# Altium project 03-425A-01A.PrjPcb (part 1 of 3)
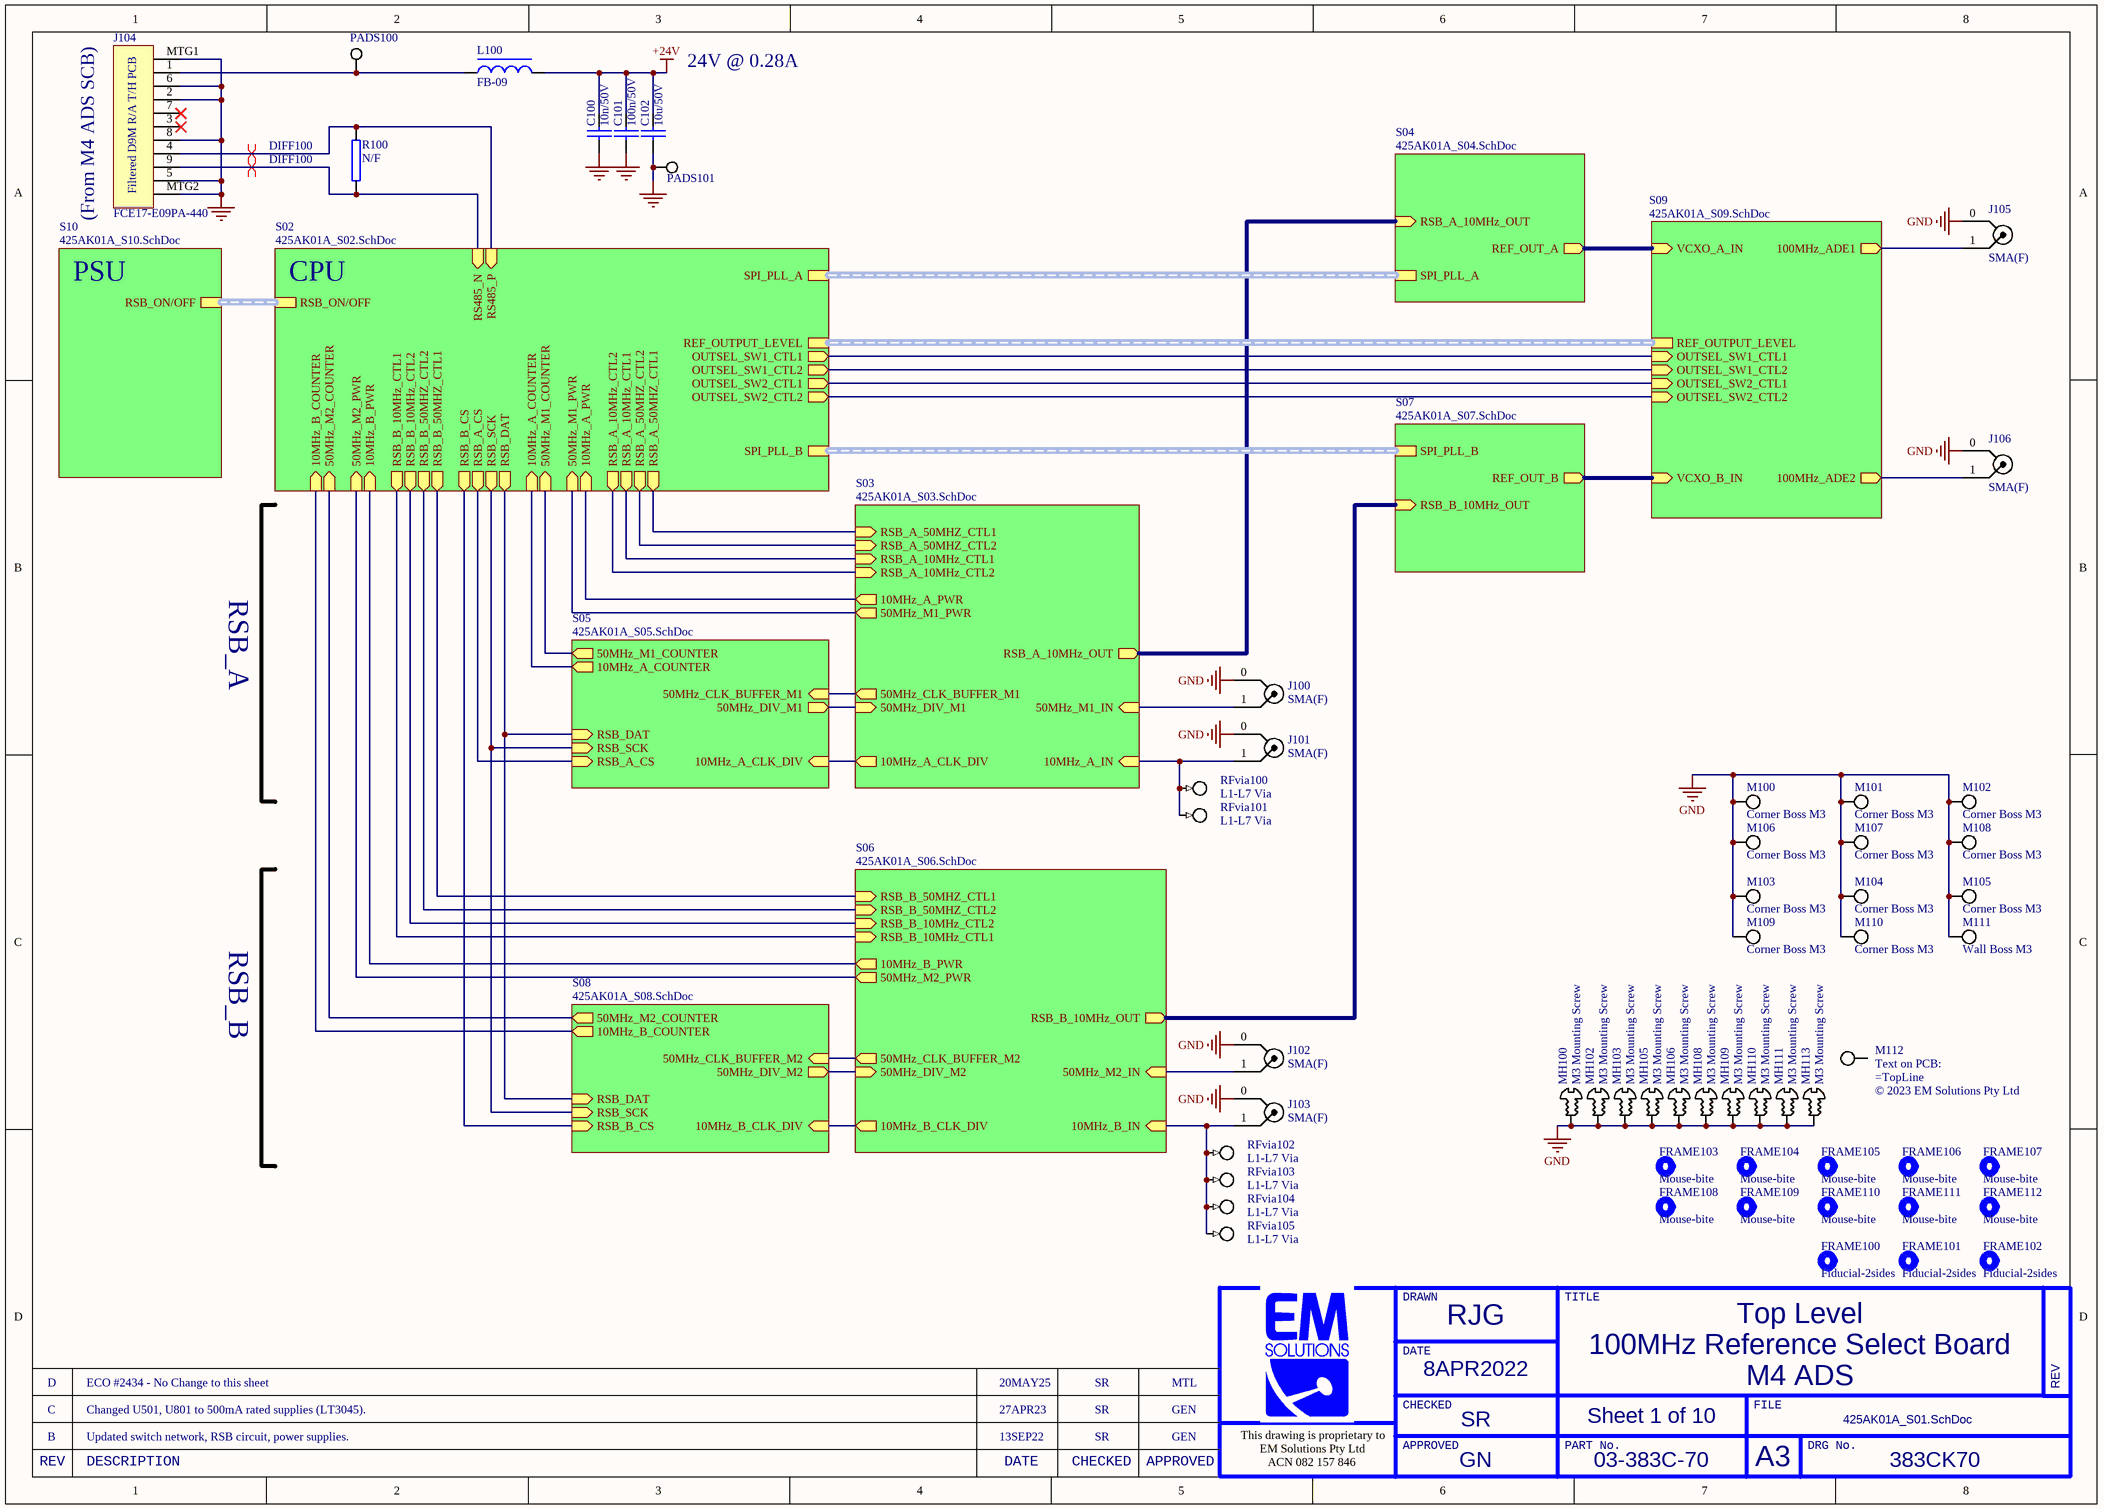
[diagram p0: 425AK01A_S01.SchDoc]
00_Approved: GEN; 00_Checked: SR; 00_Date: 22APR2022; 00_Drawn: RJG/LM; 00_Line2: 100MHz Reference Select Board; 00_Line3: M4 ADS; ItemNo: 70; ItemRev: C; ProductNo: 383C; SheetRev: D
10 sheets, 855 parts. Net scope: hierarchical (ports join the sheet entries above them; power ports are global).
Board file: 425AM01A.PcbDoc
Sheets:
  425AK01A_S01.SchDoc
    S04 = 425AK01A_S04.SchDoc
    S07 = 425AK01A_S07.SchDoc
    S09 = 425AK01A_S09.SchDoc
    S02 = 425AK01A_S02.SchDoc
    S10 = 425AK01A_S10.SchDoc
    S03 = 425AK01A_S03.SchDoc
    S05 = 425AK01A_S05.SchDoc
    S06 = 425AK01A_S06.SchDoc
    S08 = 425AK01A_S08.SchDoc

## Sheet 425AK01A_S01.SchDoc
size A3; DocumentNumber: 1; SheetNumber: 1; SheetTotal: 10; PageSetup: Record=PageOptions|CenterHorizontal=True|CenterVertical=True|PrintScale=1.01|XCorrection=1.00|YCorrection=1.00|PrintKind=1|BorderSize=5000000|LeftOffset=0|BottomOffset=0|Orientation=2|PaperLength=1000|PaperWidth=1000|Scale=100|PaperSource=15|PrintQuality=600|MediaType=1|DitherType=10|PaperKind=A3|PrintScaleMode=1; 00_Rev: D; 00_Drawn: RJG; 00_Date: 8APR2022; 00_Checked: SR; 00_Approved: GN; 00_Line2: 100MHz Reference Select Board; 00_Line3: M4 ADS; 00_Line1: Top Level

### Parts
C100  10n/50V  [0402C]
C101  100n/50V  [0402C]
C102  10u/50V  [1206C]
FRAME100  Fiducial-2sides  [Fiducial-2layers]  (no BOM)
FRAME101  Fiducial-2sides  [Fiducial-2layers]  (no BOM)
FRAME102  Fiducial-2sides  [Fiducial-2layers]  (no BOM)
FRAME103  Mouse-bite  [Breakout-3hole]  (no BOM)
FRAME104  Mouse-bite  [Breakout-3hole]  (no BOM)
FRAME105  Mouse-bite  [Breakout-3hole]  (no BOM)
FRAME106  Mouse-bite  [Breakout-3hole]  (no BOM)
FRAME107  Mouse-bite  [Breakout-3hole]  (no BOM)
FRAME108  Mouse-bite  [Breakout-3hole]  (no BOM)
FRAME109  Mouse-bite  [Breakout-3hole]  (no BOM)
FRAME110  Mouse-bite  [Breakout-3hole]  (no BOM)
FRAME111  Mouse-bite  [Breakout-3hole]  (no BOM)
FRAME112  Mouse-bite  [Breakout-3hole]  (no BOM)
J100  SMA(F)  [SMA-flange-generic]  (no BOM)
J101  SMA(F)  [SMA-flange-generic]  (no BOM)
J102  SMA(F)  [SMA-flange-generic]  (no BOM)
J103  SMA(F)  [SMA-flange-generic]  (no BOM)
J104  FCE17-E09PA-440  [Connector-D9-M-Filtered-T/H]
J105  SMA(F)  [SMA-flange-generic]  (no BOM)
J106  SMA(F)  [SMA-flange-generic]  (no BOM)
L100  FB-09  [0805L]
M100  Corner Boss M3  [Boss-corner-M3]  (no BOM)
M101  Corner Boss M3  [Boss-corner-M3]  (no BOM)
M102  Corner Boss M3  [Boss-corner-M3-rev]  (no BOM)
M103  Corner Boss M3  [Boss-corner-M3-rev]  (no BOM)
M104  Corner Boss M3  [Boss-corner-M3]  (no BOM)
M105  Corner Boss M3  [Boss-corner-M3-rev]  (no BOM)
M106  Corner Boss M3  [Boss-corner-M3]  (no BOM)
M107  Corner Boss M3  [Boss-corner-M3]  (no BOM)
M108  Corner Boss M3  [Boss-corner-M3]  (no BOM)
M109  Corner Boss M3  [Boss-corner-M3]  (no BOM)
M110  Corner Boss M3  [Boss-corner-M3]  (no BOM)
M111  Wall Boss M3  [Boss-Wall]  (no BOM)
M112  Text on PCB:  [PCB-title-V2-3mm]  (value not drawn)  (no BOM)
MH100  M3 Mounting Screw  [M3_SCREW]  (no BOM)
MH102  M3 Mounting Screw  [M3_SCREW]  (no BOM)
MH103  M3 Mounting Screw  [M3_SCREW]  (no BOM)
MH105  M3 Mounting Screw  [M3_SCREW]  (no BOM)
MH106  M3 Mounting Screw  [M3_SCREW]  (no BOM)
MH108  M3 Mounting Screw  [M3_SCREW]  (no BOM)
MH109  M3 Mounting Screw  [M3_SCREW]  (no BOM)
MH110  M3 Mounting Screw  [M3_SCREW]  (no BOM)
MH111  M3 Mounting Screw  [M3_SCREW]  (no BOM)
MH113  M3 Mounting Screw  [M3_SCREW]  (no BOM)
PADS100  Pads  [Pads-1x3-V3-0.3/0.6mm]  (value not drawn)  (net tie, no BOM)
PADS101  Pads  [Pads-1x3-V3-0.3/0.6mm]  (value not drawn)  (net tie, no BOM)
R100  N/F  [0805]
RFvia100  L1-L7 Via  [RFvia_L1-L7]  (no BOM)
RFvia101  L1-L7 Via  [RFvia_L1-L7]  (no BOM)
RFvia102  L1-L7 Via  [RFvia_L1-L7]  (no BOM)
RFvia103  L1-L7 Via  [RFvia_L1-L7]  (no BOM)
RFvia104  L1-L7 Via  [RFvia_L1-L7]  (no BOM)
RFvia105  L1-L7 Via  [RFvia_L1-L7]  (no BOM)

### Sub-sheets
S02 = 425AK01A_S02.SchDoc: SPI_PLL_B (harness SPI_PLL), REF_OUTPUT_LEVEL (harness REF_OUTPUT_LEVEL), SPI_PLL_A (harness SPI_PLL), RSB_ON/OFF (harness RSB_ON/OFF), 50MHz_M1_COUNTER (in), 10MHz_A_COUNTER (in), RSB_DAT (out), RSB_SCK (out), RSB_A_CS (out), RSB_B_CS (out), 10MHz_B_COUNTER (in), 50MHz_M1_PWR (in), 10MHz_A_PWR (in), RSB_A_10MHz_CTL2 (out), RSB_A_10MHz_CTL1 (out), RSB_A_50MHZ_CTL2 (out), RSB_A_50MHZ_CTL1 (out), 50MHz_M2_COUNTER (in), RSB_B_50MHZ_CTL1 (out), RSB_B_50MHZ_CTL2 (out), RSB_B_10MHz_CTL2 (out), RSB_B_10MHz_CTL1 (out), 10MHz_B_PWR (in), 50MHz_M2_PWR (in), RS485_N (in), RS485_P (in), OUTSEL_SW1_CTL1 (out), OUTSEL_SW2_CTL2 (out), OUTSEL_SW2_CTL1 (out), OUTSEL_SW1_CTL2 (out)
S03 = 425AK01A_S03.SchDoc: RSB_A_10MHz_OUT (out), 50MHz_CLK_BUFFER_M1 (out), 10MHz_A_PWR (out), 10MHz_A_CLK_DIV (out), 50MHz_M1_PWR (out), 50MHz_M1_IN (in), 50MHz_DIV_M1 (in), RSB_A_50MHZ_CTL1 (in), RSB_A_50MHZ_CTL2 (in), RSB_A_10MHz_CTL1 (in), RSB_A_10MHz_CTL2 (in), 10MHz_A_IN (in)
S04 = 425AK01A_S04.SchDoc: SPI_PLL_A (harness SPI_PLL), RSB_A_10MHz_OUT (in), REF_OUT_A (out)
S05 = 425AK01A_S05.SchDoc: 10MHz_A_COUNTER (out), 50MHz_M1_COUNTER (out), 50MHz_DIV_M1 (out), 10MHz_A_CLK_DIV (in), 50MHz_CLK_BUFFER_M1 (in), RSB_A_CS (in), RSB_DAT (in), RSB_SCK (in)
S06 = 425AK01A_S06.SchDoc: RSB_B_10MHz_OUT (out), 10MHz_B_IN (in), RSB_B_50MHZ_CTL1 (in), RSB_B_10MHz_CTL2 (in), RSB_B_10MHz_CTL1 (in), 10MHz_B_CLK_DIV (out), 10MHz_B_PWR (out), RSB_B_50MHZ_CTL2 (in), 50MHz_M2_PWR (out), 50MHz_CLK_BUFFER_M2 (out), 50MHz_M2_IN (in), 50MHz_DIV_M2 (in)
S07 = 425AK01A_S07.SchDoc: SPI_PLL_B (harness SPI_PLL), RSB_B_10MHz_OUT (in), REF_OUT_B (out)
S08 = 425AK01A_S08.SchDoc: RSB_DAT (in), 10MHz_B_CLK_DIV (in), 10MHz_B_COUNTER (out), RSB_B_CS (in), RSB_SCK (in), 50MHz_M2_COUNTER (out), 50MHz_DIV_M2 (out), 50MHz_CLK_BUFFER_M2 (in)
S09 = 425AK01A_S09.SchDoc: REF_OUTPUT_LEVEL (harness REF_OUTPUT_LEVEL), VCXO_A_IN (in), VCXO_B_IN (in), 100MHz_ADE2 (out), 100MHz_ADE1 (out), OUTSEL_SW2_CTL1 (in), OUTSEL_SW1_CTL2 (in), OUTSEL_SW2_CTL2 (in), OUTSEL_SW1_CTL1 (in)
S10 = 425AK01A_S10.SchDoc: RSB_ON/OFF (harness RSB_ON/OFF)

### Nets
+24V: C100.1 C101.1 C102.1 L100.2
GND: C100.2 C101.2 C102.2 J100.0 J101.0 J102.0 J103.0 J104.2 J104.5 J104.6 J104.8 J104.MTG1 J104.MTG2 J105.0 J106.0 M100.1 M101.1 M102.1 M103.1 M104.1 M105.1 M106.1 M107.1 M108.1 M109.1 M110.1 M111.1 MH100.1 MH102.1 MH103.1 MH105.1 MH106.1 MH108.1 MH109.1 MH110.1 MH111.1 MH113.1 PADS101.1
RS485_N: J104.9 R100.1 ; sheet S02/RS485_N
RS485_P: J104.4 R100.2 ; sheet S02/RS485_P
RSB_A_CS: sheet S02/RSB_A_CS, sheet S05/RSB_A_CS
RSB_B_CS: sheet S02/RSB_B_CS, sheet S08/RSB_B_CS
RSB_DAT: sheet S02/RSB_DAT, sheet S05/RSB_DAT, sheet S08/RSB_DAT
RSB_SCK: sheet S02/RSB_SCK, sheet S05/RSB_SCK, sheet S08/RSB_SCK
NetC304_2: J100.1 ; sheet S03/50MHz_M1_IN
NetC335_1: J101.1 RFvia100.1 RFvia101.1 ; sheet S03/10MHz_A_IN
NetC405_1: sheet S04/RSB_A_10MHz_OUT, sheet S03/RSB_A_10MHz_OUT
NetC529_1: sheet S02/50MHz_M1_COUNTER, sheet S05/50MHz_M1_COUNTER
NetC530_1: sheet S02/10MHz_A_COUNTER, sheet S05/10MHz_A_COUNTER
NetC604_2: J102.1 ; sheet S06/50MHz_M2_IN
NetC635_1: J103.1 RFvia102.1 RFvia103.1 RFvia104.1 RFvia105.1 ; sheet S06/10MHz_B_IN
NetC705_1: sheet S07/RSB_B_10MHz_OUT, sheet S06/RSB_B_10MHz_OUT
NetC829_1: sheet S02/50MHz_M2_COUNTER, sheet S08/50MHz_M2_COUNTER
NetC830_1: sheet S02/10MHz_B_COUNTER, sheet S08/10MHz_B_COUNTER
NetC904_1: sheet S04/REF_OUT_A, sheet S09/VCXO_A_IN
NetC908_2: J105.1 ; sheet S09/100MHz_ADE1
NetC927_2: J106.1 ; sheet S09/100MHz_ADE2
NetC928_1: sheet S07/REF_OUT_B, sheet S09/VCXO_B_IN
NetJ104_1: J104.1 L100.1 PADS100.1
NetL305_2: sheet S02/RSB_A_50MHZ_CTL2, sheet S03/RSB_A_50MHZ_CTL2
NetL306_2: sheet S02/RSB_A_50MHZ_CTL1, sheet S03/RSB_A_50MHZ_CTL1
NetL310_2: sheet S02/RSB_A_10MHz_CTL2, sheet S03/RSB_A_10MHz_CTL2
NetL311_2: sheet S02/RSB_A_10MHz_CTL1, sheet S03/RSB_A_10MHz_CTL1
NetL605_2: sheet S02/RSB_B_50MHZ_CTL2, sheet S06/RSB_B_50MHZ_CTL2
NetL606_2: sheet S02/RSB_B_50MHZ_CTL1, sheet S06/RSB_B_50MHZ_CTL1
NetL610_2: sheet S02/RSB_B_10MHz_CTL2, sheet S06/RSB_B_10MHz_CTL2
NetL611_2: sheet S02/RSB_B_10MHz_CTL1, sheet S06/RSB_B_10MHz_CTL1
NetL905_1: sheet S09/OUTSEL_SW1_CTL2, sheet S02/OUTSEL_SW1_CTL2
NetL906_1: sheet S09/OUTSEL_SW1_CTL1, sheet S02/OUTSEL_SW1_CTL1
NetL912_1: sheet S09/OUTSEL_SW2_CTL2, sheet S02/OUTSEL_SW2_CTL2
NetL913_1: sheet S09/OUTSEL_SW2_CTL1, sheet S02/OUTSEL_SW2_CTL1
NetR302_1: sheet S03/50MHz_CLK_BUFFER_M1, sheet S05/50MHz_CLK_BUFFER_M1
NetR316_1: sheet S02/50MHz_M1_PWR, sheet S03/50MHz_M1_PWR
NetR329_1: sheet S02/10MHz_A_PWR, sheet S03/10MHz_A_PWR
NetR331_1: sheet S03/10MHz_A_CLK_DIV, sheet S05/10MHz_A_CLK_DIV
NetR504_1: sheet S03/50MHz_DIV_M1, sheet S05/50MHz_DIV_M1
NetR602_1: sheet S06/50MHz_CLK_BUFFER_M2, sheet S08/50MHz_CLK_BUFFER_M2
NetR616_1: sheet S02/50MHz_M2_PWR, sheet S06/50MHz_M2_PWR
NetR629_1: sheet S02/10MHz_B_PWR, sheet S06/10MHz_B_PWR
NetR631_1: sheet S06/10MHz_B_CLK_DIV, sheet S08/10MHz_B_CLK_DIV
NetR804_1: sheet S06/50MHz_DIV_M2, sheet S08/50MHz_DIV_M2

Not connected (* = marked no-connect by the designer): J104 3* 7*; M112 1

### Buses and harness runs
harness sheet S02/REF_OUTPUT_LEVEL = sheet S09/REF_OUTPUT_LEVEL
harness sheet S02/RSB_ON/OFF = sheet S10/RSB_ON/OFF
harness sheet S02/SPI_PLL_A = sheet S04/SPI_PLL_A
harness sheet S02/SPI_PLL_B = sheet S07/SPI_PLL_B

### Layout directives
differential pair; differential pair class DIFF100; Parameter 1: DIFF100: RS485_N, RS485_P

### Notes on the sheet
- 24V @ 0.28A
- (From M4 ADS SCB)
- PSU
- CPU
- RSB_A
- RSB_B
- D
- ECO #2434 - No Change to this sheet
- 20MAY25
- SR
- MTL
- B
- C
- Updated switch network, RSB circuit, power supplies.
- Changed U501, U801 to 500mA rated supplies (LT3045).
- 13SEP22
- 27APR23
- GEN
- DRAWN
- TITLE
- DATE
- REV
- This drawing is proprietary to
- EM Solutions Pty Ltd
- APPROVED
- CHECKED
- PART No.
- FILE
- A3
- DRG No.
- DESCRIPTION
- ACN 082 157 846
- (in symbol Connector-D9-M-Filtered-T/H_PCBorder) Filtered D9M R/A T/H PCB

### Library data of the parts
C100 = 41-010N-12: Capacitor, 0402, 10n X7R 10% 50V Ceramic, NiSn; MANUFACTURER: MURATA; MODELNAME: GCM155R71H103KA55D; ID: 2217; Part Number: 41-010N-12; ItemID: 41-010N-12
C101 = 41-100N-13: Capacitor, 0402, 100n, X7R, 10% 50V, Ceramic; MANUFACTURER: MURATA; MODELNAME: GRM155R71H104KE14J; ID: 2441; Part Number: 41-100N-13; ItemID: 41-100N-13
C102 = 41-010U-13: Capacitor, 1206, 10u X7R 10% 50V Ceramic, NiSn; MANUFACTURER: SAMSUNG; MODELNAME: CL31B106KBHNNNE; ID: 2237; Part Number: 41-010U-13; ItemID: 41-010U-13
FRAME100-FRAME102 = Fiducial-2sides: Fiducial on both sides of the PCB
FRAME103-FRAME112 = Breakout: Add design rule: / BoardOutlineClearance_Breakouts, name like 'FRAME*-NoDRC', 0
J100-J103 J105 J106 = Connector-SMA-edge: Generic SMA bulkhead connector. Grounding via chassis.; Part Number: 30-P-01
J104 = Connector-D9-M-Filtered-T/H_PCBorder: Amphenol FCE17-E09PA-440 D9M Filtered R/A T/H connector; Part Number: 20-D9-10
L100 = 46-B-09: Solid Inductor, 1000ohm@100MHz, DCR=0.15, 1A, 0805 size; MANUFACTURER: LAIRD; MODELNAME: MI0805J102R-10; ID: 3254; Part Number: 46-B-09; ItemID: 46-B-09
M100-M110 = Boss-Corner-M3
M111 = Boss-M3-Wall
M112 = Title of PCB: Edit parameter "MidLine" to insert the name of the PCB. / NOTE: Update copyright year as needed.; TopLine: P/N: 04-383C-70 Rev C; MidLine: © 2023 EM Solutions Pty Ltd
MH100 MH102 MH103 MH105 MH106 MH108-MH111 MH113 = M3 Screw
PADS100 PADS101 = Pads: Cluster of pads
R100 = 44-N/F-09: Resistor, 0805, SOT, Not Fitted; MANUFACTURER: PHILIPS; ID: 3110; MODELNAME: RC12H; Part Number: 44-N/F-09; ItemID: 44-N/F-09
RFvia100-RFvia105 = RFvia_L1-L7: RF Via from layer 1 to layer 7, on an 8-layer board.; Rule: UNIONINDEX=0|RULEKIND=PlaneClearance|NETSCOPE=AnyNet|LAYERKIND=SameLayer|NAME=Schematic Power Plane Clearance|CLEARANCE=13.7795mil|UNIT=Imperial

## Sheet 425AK01A_S04.SchDoc
size A3; DocumentNumber: 4; SheetNumber: 4; SheetTotal: 10; PageSetup: Record=PageOptions|CenterHorizontal=True|CenterVertical=True|PrintScale=1.01|XCorrection=1.00|YCorrection=1.00|PrintKind=1|BorderSize=5000000|LeftOffset=0|BottomOffset=0|Orientation=2|PaperLength=1000|PaperWidth=1000|Scale=100|PaperSource=15|PrintQuality=600|MediaType=1|DitherType=10|PaperKind=A3|PrintScaleMode=1; 00_Rev: D; 00_Drawn: RJG; 00_Date: 8APR2022; 00_Checked: SR; 00_Approved: GN; 00_Line2: 100MHz Reference Select Board; 00_Line3: M4 ADS; 00_Line1: VCXO/PLL PATH A
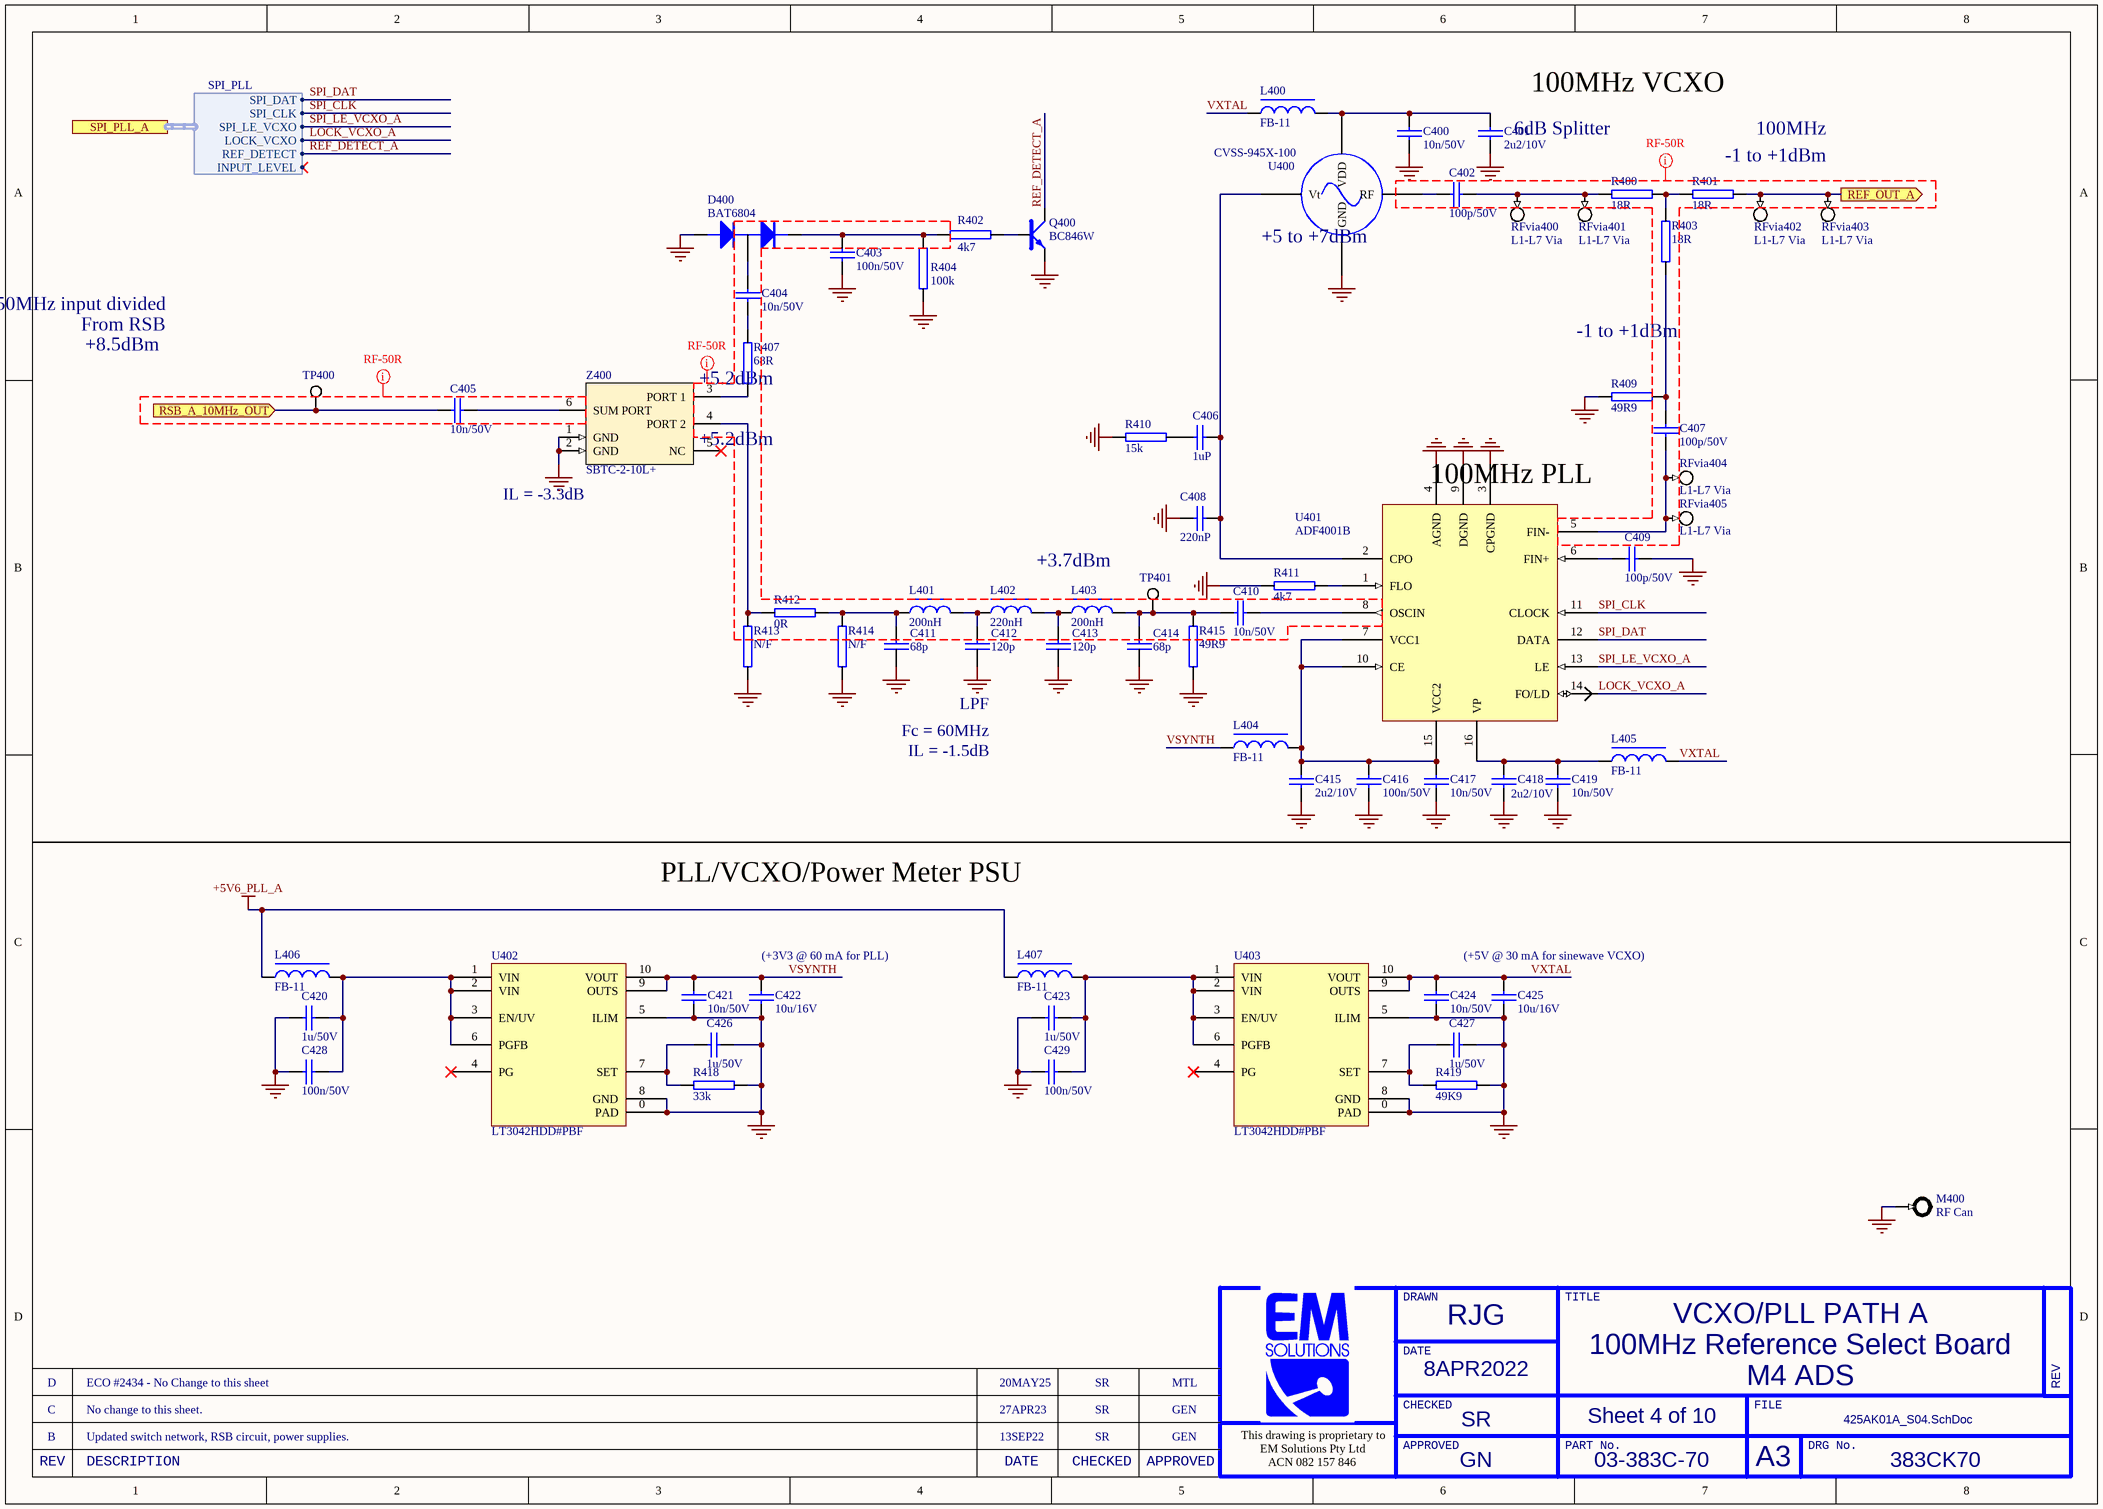
[diagram p1: 425AK01A_S04.SchDoc]

### Parts
C400  10n/50V  [0402C]
C401  2u2/10V  [0603C]
C402  100p/50V  [0402C]
C403  100n/50V  [0402C]
C404  10n/50V  [0402C]
C405  10n/50V  [0402C]
C406  1uP  [1210C]
C407  100p/50V  [0402C]
C408  220nP  [1206C]
C409  100p/50V  [0402C]
C410  10n/50V  [0402C]
C411  68p  [0402C]
C412  120p  [0402C]
C413  120p  [0402C]
C414  68p  [0402C]
C415  2u2/10V  [0603C]
C416  100n/50V  [0402C]
C417  10n/50V  [0402C]
C418  2u2/10V  [0603C]
C419  10n/50V  [0402C]
C420  1u/50V  [0603C]
C421  10n/50V  [0402C]
C422  10u/16V  [0805C]
C423  1u/50V  [0603C]
C424  10n/50V  [0402C]
C425  10u/16V  [0805C]
C426  1u/50V  [0603C]
C427  1u/50V  [0603C]
C428  100n/50V  [0402C]
C429  100n/50V  [0402C]
D400  BAT6804  [SOT-23DAP]
L400  FB-11  [0402L]
L401  200nH  [0402L]
L402  220nH  [0402L]
L403  200nH  [0402L]
L404  FB-11  [0402L]
L405  FB-11  [0402L]
L406  FB-11  [0402L]
L407  FB-11  [0402L]
M400  RF Can  [Can_38x25.4x6mm]
Q400  BC846W  [SOT-323BJT]
R400  18R  [0402]
R401  18R  [0402]
R402  4k7  [0402]
R403  18R  [0402]
R404  100k  [0402]
R407  68R  [0402]
R409  49R9  [0402]
R410  15k  [0402]
R411  4k7  [0402]
R412  0R  [0402]
R413  N/F  [0402]
R414  N/F  [0402]
R415  49R9  [0402]
R418  33k  [0402]
R419  49K9  [0402]
RFvia400  L1-L7 Via  [RFvia_L1-L7]  (no BOM)
RFvia401  L1-L7 Via  [RFvia_L1-L7]  (no BOM)
RFvia402  L1-L7 Via  [RFvia_L1-L7]  (no BOM)
RFvia403  L1-L7 Via  [RFvia_L1-L7]  (no BOM)
RFvia404  L1-L7 Via  [RFvia_L1-L7]  (no BOM)
RFvia405  L1-L7 Via  [RFvia_L1-L7]  (no BOM)
TP400  Pad  [Testpoint-0.5mm-SMT-withPaste]  (value not drawn)  (no BOM)
TP401  Pad  [Testpoint-0.5mm-SMT-withPaste]  (value not drawn)  (no BOM)
U400  CVSS-945X-100  [CVHD-950]
U401  ADF4001B  [TSSOP-16]
U402  LT3042HDD#PBF  [DFN50P300X300X80_HS-11N]
U403  LT3042HDD#PBF  [DFN50P300X300X80_HS-11N]
Z400  SBTC-2-10L+  [SBTC-2-10L+]

### Ports
REF_OUT_A (out), RSB_A_10MHz_OUT (in), SPI_PLL_A (harness SPI_PLL)

### Harnesses
SPI_PLL: SPI_LE_VCXO, SPI_CLK, SPI_DAT, REF_DETECT, LOCK_VCXO, INPUT_LEVEL

### Nets
+5V6_PLL_A: L406.2 L407.2
GND: C400.2 C401.2 C403.1 C408.1 C409.2 C411.1 C412.1 C413.1 C414.1 C415.2 C416.2 C417.2 C418.2 C419.2 C420.1 C421.1 C422.2 C423.1 C424.1 C425.2 C426.2 C427.2 C428.2 C429.2 D400.A M400.0 Q400.E R404.1 R409.2 R410.2 R411.1 R413.1 R414.1 R415.1 R418.1 R419.1 U400.2(GND) U401.3(CPGND) U401.4(AGND) U401.9(DGND) U402.0(PAD) U402.5(ILIM) U402.8(GND) U403.0(PAD) U403.5(ILIM) U403.8(GND) Z400.1(GND) Z400.2(GND)
LOCK_VCXO_A: U401.14(FO/LD) ; port SPI_PLL_A.LOCK_VCXO
REF_DETECT_A: Q400.C ; port SPI_PLL_A.REF_DETECT
SPI_CLK: U401.11(CLOCK) ; port SPI_PLL_A.SPI_CLK
SPI_DAT: U401.12(DATA) ; port SPI_PLL_A.SPI_DAT
SPI_LE_VCXO_A: U401.13(LE) ; port SPI_PLL_A.SPI_LE_VCXO
VSYNTH: C421.2 C422.1 L404.1 U402.9(OUTS) U402.10(VOUT)
VXTAL: C424.2 C425.1 L400.1 L405.2 U403.9(OUTS) U403.10(VOUT)
NetC400_1: C400.1 C401.1 L400.2 U400.4(VDD)
NetC402_1: C402.1 R400.1 RFvia400.1 RFvia401.1
NetC402_2: C402.2 U400.3(RF)
NetC403_2: C403.2 D400.K R402.2 R404.2
NetC404_1: C404.1 R407.2
NetC404_2: C404.2 D400.KA
NetC405_1: C405.1 TP400.1 ; port RSB_A_10MHz_OUT
NetC405_2: C405.2 Z400.6(SUM_PORT)
NetC406_1: C406.1 C408.2 U400.1(Vt) U401.2(CPO)
NetC406_2: C406.2 R410.1
NetC407_1: C407.1 R403.2 R409.1
NetC407_2: C407.2 RFvia404.1 RFvia405.1 U401.5(FIN-)
NetC409_1: C409.1 U401.6(FIN+)
NetC410_1: C410.1 C414.2 L403.2 R415.2 TP401.1
NetC410_2: C410.2 U401.8(OSCIN)
NetC411_2: C411.2 L401.1 R412.1 R414.2
NetC412_2: C412.2 L401.2 L402.1
NetC413_2: C413.2 L402.2 L403.1
NetC415_1: C415.1 C416.1 C417.1 L404.2 U401.7(VCC1) U401.10(CE) U401.15(VCC2)
NetC418_1: C418.1 C419.1 L405.1 U401.16(VP)
NetC420_2: C420.2 C428.1 L406.1 U402.1(VIN) U402.2(VIN) U402.3(EN/UV) U402.6(PGFB)
NetC423_2: C423.2 C429.1 L407.1 U403.1(VIN) U403.2(VIN) U403.3(EN/UV) U403.6(PGFB)
NetC426_1: C426.1 R418.2 U402.7(SET)
NetC427_1: C427.1 R419.2 U403.7(SET)
NetC904_1: R401.2 RFvia402.1 RFvia403.1 ; port REF_OUT_A
NetQ400_B: Q400.B R402.1
NetR400_2: R400.2 R401.1 R403.1
NetR407_1: R407.1 Z400.3(PORT_1)
NetR411_2: R411.2 U401.1(FLO)
NetR412_2: R412.2 R413.2 Z400.4(PORT_2)

Not connected (* = marked no-connect by the designer): U402 4(PG)*; U403 4(PG)*; Z400 5(NC)*

### Layout directives
net class RF-50R: (no net found under the mark), GND

### Notes on the sheet
- 100MHz VCXO
- 6dB Splitter
- 100MHz
- (near RFvia403) -1 to +1dBm
- (near U400) +5 to +7dBm
- 10MHz from 10MHz input or 50MHz input divided
- +8.5dBm
- From RSB
- -1 to +1dBm
- (near R407) +5.2dBm
- +5.2dBm
- (near Z400) IL = -3.3dB
- (near U401) 100MHz PLL
- +3.7dBm
- LPF
- Fc = 60MHz
- IL = -1.5dB
- PLL/VCXO/Power Meter PSU
- (near C422) (+3V3 @ 60 mA for PLL)
- (+5V @ 30 mA for sinewave VCXO)
- D
- ECO #2434 - No Change to this sheet
- 20MAY25
- SR
- MTL
- B
- C
- Updated switch network, RSB circuit, power supplies.
- No change to this sheet.
- 13SEP22
- 27APR23
- GEN
- DRAWN
- TITLE
- DATE
- REV
- This drawing is proprietary to
- EM Solutions Pty Ltd
- APPROVED
- CHECKED
- PART No.
- FILE
- A3
- DRG No.
- DESCRIPTION
- ACN 082 157 846

### Library data of the parts
C400 C404 C410 C417 C419 C421 C424 = 41-010N-12: Capacitor, 0402, 10n X7R 10% 50V Ceramic, NiSn; MANUFACTURER: MURATA; ID: 2217; MODELNAME: GCM155R71H103KA55D; Part Number: 41-010N-12; ItemID: 41-010N-12
C401 C415 C418 = 41-02U2-06: Capacitor, 0603, 2u2 X7R 10% 10V Ceramic, NiSn; MANUFACTURER: MURATA; ID: 2333; MODELNAME: GRM188R71A225KE15D; Part Number: 41-02U2-06; ItemID: 41-02U2-06
C402 = 41-100P-11: Capacitor, 0402, 100p NPO 5% 50V Ceramic, AEC-Q200; MANUFACTURER: TDK; MODELNAME: CGA2B2C0G1H101J050BA; ID: 2448; Part Number: 41-100P-11; ItemID: 41-100P-11
C403 C416 C428 C429 = 41-100N-13: Capacitor, 0402, 100n, X7R, 10% 50V, Ceramic; MANUFACTURER: MURATA; ID: 2441; MODELNAME: GRM155R71H104KE14J; Part Number: 41-100N-13; ItemID: 41-100N-13
C405 = 41-010N-12: as C100 on sheet 425AK01A_S01; Part Number: 41-010N-12; ItemID: 41-010N-12
C406 = 41-01U0-05: Capacitor, 1210, 1u PPS 20% 16V Plastic Film; MANUFACTURER: PANASONIC; ID: 2286; MODELNAME: ECPU1C105MA5; Part Number: 41-01U0-05; ItemID: 41-01U0-05
C407 C409 = 41-100P-11: Capacitor, 0402, 100p NPO 5% 50V Ceramic, AEC-Q200; MANUFACTURER: TDK; ID: 2448; MODELNAME: CGA2B2C0G1H101J050BA; Part Number: 41-100P-11; ItemID: 41-100P-11
C408 = 41-220N-05: Capacitor, 1206, 220n PPS 20% 16V Plastic Film; MANUFACTURER: PANASONIC; ID: 2468; MODELNAME: ECPU1C224MA5; Part Number: 41-220N-05; ItemID: 41-220N-05
C411 C414 = 41-068P-08: Capacitor, 0402, 68p; Part Number: 41-068P-08
C412 C413 = 41-120P-05: Capacitor, 0402, 120p NPO; Part Number: 41-120P-05
C420 C423 C426 C427 = 41-01U0-06: Capacitor, 0603, 1u X7R 10% 50V Ceramic, NiSn; MANUFACTURER: TAIYOYUDEN; MODELNAME: UMK107AB7105KA; ID: 2287; Part Number: 41-01U0-06; ItemID: 41-01U0-06
C422 C425 = 41-010U-08: Capacitor, 0805, 10u X7R 10% 16V Ceramic, NiSn; MANUFACTURER: SAMSUNG; ID: 2232; MODELNAME: CL21B106KOQNNNE; Part Number: 41-010U-08; ItemID: 41-010U-08
D400 = 60-BAT68-04: *Diode, Schottky, Series Pair, 8V 130mA, SOT-23-3; MANUFACTURER: INFINEON; ID: 3625; MODELNAME: BAT6804E6327HTSA1; Part Number: 60-BAT68-04; ItemID: 60-BAT68-04
L400 L404 L405 = 46-B-11: Solid Inductor, 600ohm@100MHz, DCR=0.52, 0.3A, 0402 size; MANUFACTURER: TDK; ID: 3256; MODELNAME: MMZ1005S601C; Part Number: 46-B-11; ItemID: 46-B-11
L401 L403 = 46-200N-04: Inductor, Chip, 200nH, 0402; Part Number: 46-200N-04
L402 = 46-220N-05: Inductor, Chip, 220nH, 0402; Part Number: 46-220N-05
L406 L407 = 46-B-11: Solid Inductor, 600ohm@100MHz, DCR=0.52, 0.3A, 0402 size; MANUFACTURER: TDK; MODELNAME: MMZ1005S601C; ID: 3256; Part Number: 46-B-11; ItemID: 46-B-11
M400 = Can-RF: Part Number: 11-0256
Q400 = 62-BC846-01: Transistor, NPN Si, GenPur 65V 100mA, SOT-323; MANUFACTURER: TAIWAN SEMI; ID: 3683; MODELNAME: BC846CW RF; Part Number: 62-BC846-01; ItemID: 62-BC846-01
R400 R401 R403 = 44-018R-10: Resistor, 0402, 18R 1% 0.063W; MANUFACTURER: GENERIC; ID: 2594; Part Number: 44-018R-10; ItemID: 44-018R-10; MODELNAME: GENERIC
R402 R411 = 44-04K7-10: Resistor, 0402, 4k7 1% 0.063W; MANUFACTURER: PHILIPS; ID: 2794; MODELNAME: ERJ-2RKF4701X; Part Number: 44-04K7-10; ItemID: 44-04K7-10
R404 = 44-100K-10: Resistor, 0402, 100k 1% 0.063W; MANUFACTURER: PHILIPS; ID: 2931; MODELNAME: RC32H; Part Number: 44-100K-10; ItemID: 44-100K-10
R407 = 44-068R-10: Resistor, 0402, 68R 1% 0.063W; MANUFACTURER: PHILIPS; MODELNAME: RC32H; ID: 2849; Part Number: 44-068R-10; ItemID: 44-068R-10
R409 R415 = 44-049R9-10: Resistor, 0402, 49R9 1% 0.063W; MANUFACTURER: YAGEO; ID: 2787; MODELNAME: RC0402FR-0749R9L; Part Number: 44-049R9-10; ItemID: 44-049R9-10
R410 = 44-015K-10: Resistor, 0402, 15k 1% 0.063W; MANUFACTURER: PHILIPS; MODELNAME: RC32H; ID: 2575; Part Number: 44-015K-10; ItemID: 44-015K-10
R412 = 44-000R-10: Resistor, 0402, 0R 1% 0.063W; MANUFACTURER: GENERIC; ID: 2538; Part Number: 44-000R-10; ItemID: 44-000R-10; MODELNAME: GENERIC
R413 R414 = 44-N/F-10: Resistor, 0402, SOT, Not Fitted; ID: 3111; Part Number: 44-N/F-10; ItemID: 44-N/F-10
R418 = 44-033K-10: Resistor, 0402, 33k 1% 0.063W; MANUFACTURER: PHILIPS; MODELNAME: RC32H; ID: 2720; Part Number: 44-033K-10; ItemID: 44-033K-10
R419 = 44-49K9-01: Resistor, 0402, 49.9K, 1%, 0.1W, ThickFilm, AEC-Q200; MANUFACTURER: PANASONIC; MODELNAME: ERJ-2RKF4992X; ID: 3061; Part Number: 44-49K9-01; ItemID: 44-49K9-01
RFvia400-RFvia405 = RFvia_L1-L7: as RFvia100 on sheet 425AK01A_S01
TP400 TP401 = Pad: Pad that can be a test point or a hot via
U400 = 35-0223: VCXO, 100.00MHz, Sine 5V, SMD; MANUFACTURER: CRYSTEK; ID: 2098; Part Number: 35-0223; ItemID: 35-0223; MODELNAME: CVSS-945X-100
U401 = 54-4001-01: PLL Clock Gen, 200MHz, Serial TSSOP-16; MANUFACTURER: ANLG DEV; ID: 3488; Part Number: 54-4001-01; ItemID: 54-4001-01; MODELNAME: ADF4001BRUZ
U402 U403 = 52-3042-01: Volt Regulator, Vin=1.8-20V, Vin=0-15V, 200mA, Low Noise, -40to+125C; MANUFACTURER: ANLG DEV; MODELNAME: LT3042IDD#PBF; ID: 3361; Part Number: 52-3042-01; ItemID: 52-3042-01
Z400 = 33-0055: Divider/Combiner, 2 Way, 0 deg, 10 -1000MHz, Tx Line Tranformer; MANUFACTURER: MINICCTS; ID: 2075; Part Number: 33-0055; MODELNAME: SBTC-2-10L+; ItemID: 33-0055

## Sheet 425AK01A_S07.SchDoc
size A3; DocumentNumber: 7; SheetNumber: 7; SheetTotal: 10; PageSetup: Record=PageOptions|CenterHorizontal=True|CenterVertical=True|PrintScale=1.01|XCorrection=1.00|YCorrection=1.00|PrintKind=1|BorderSize=5000000|LeftOffset=0|BottomOffset=0|Orientation=2|PaperLength=1000|PaperWidth=1000|Scale=100|PaperSource=15|PrintQuality=600|MediaType=1|DitherType=10|PaperKind=A3|PrintScaleMode=1; 00_Rev: D; 00_Drawn: RJG; 00_Date: 8APR2022; 00_Checked: SR; 00_Approved: GN; 00_Line2: 100MHz Reference Select Board; 00_Line3: M4 ADS; 00_Line1: VCXO/PLL PATH B
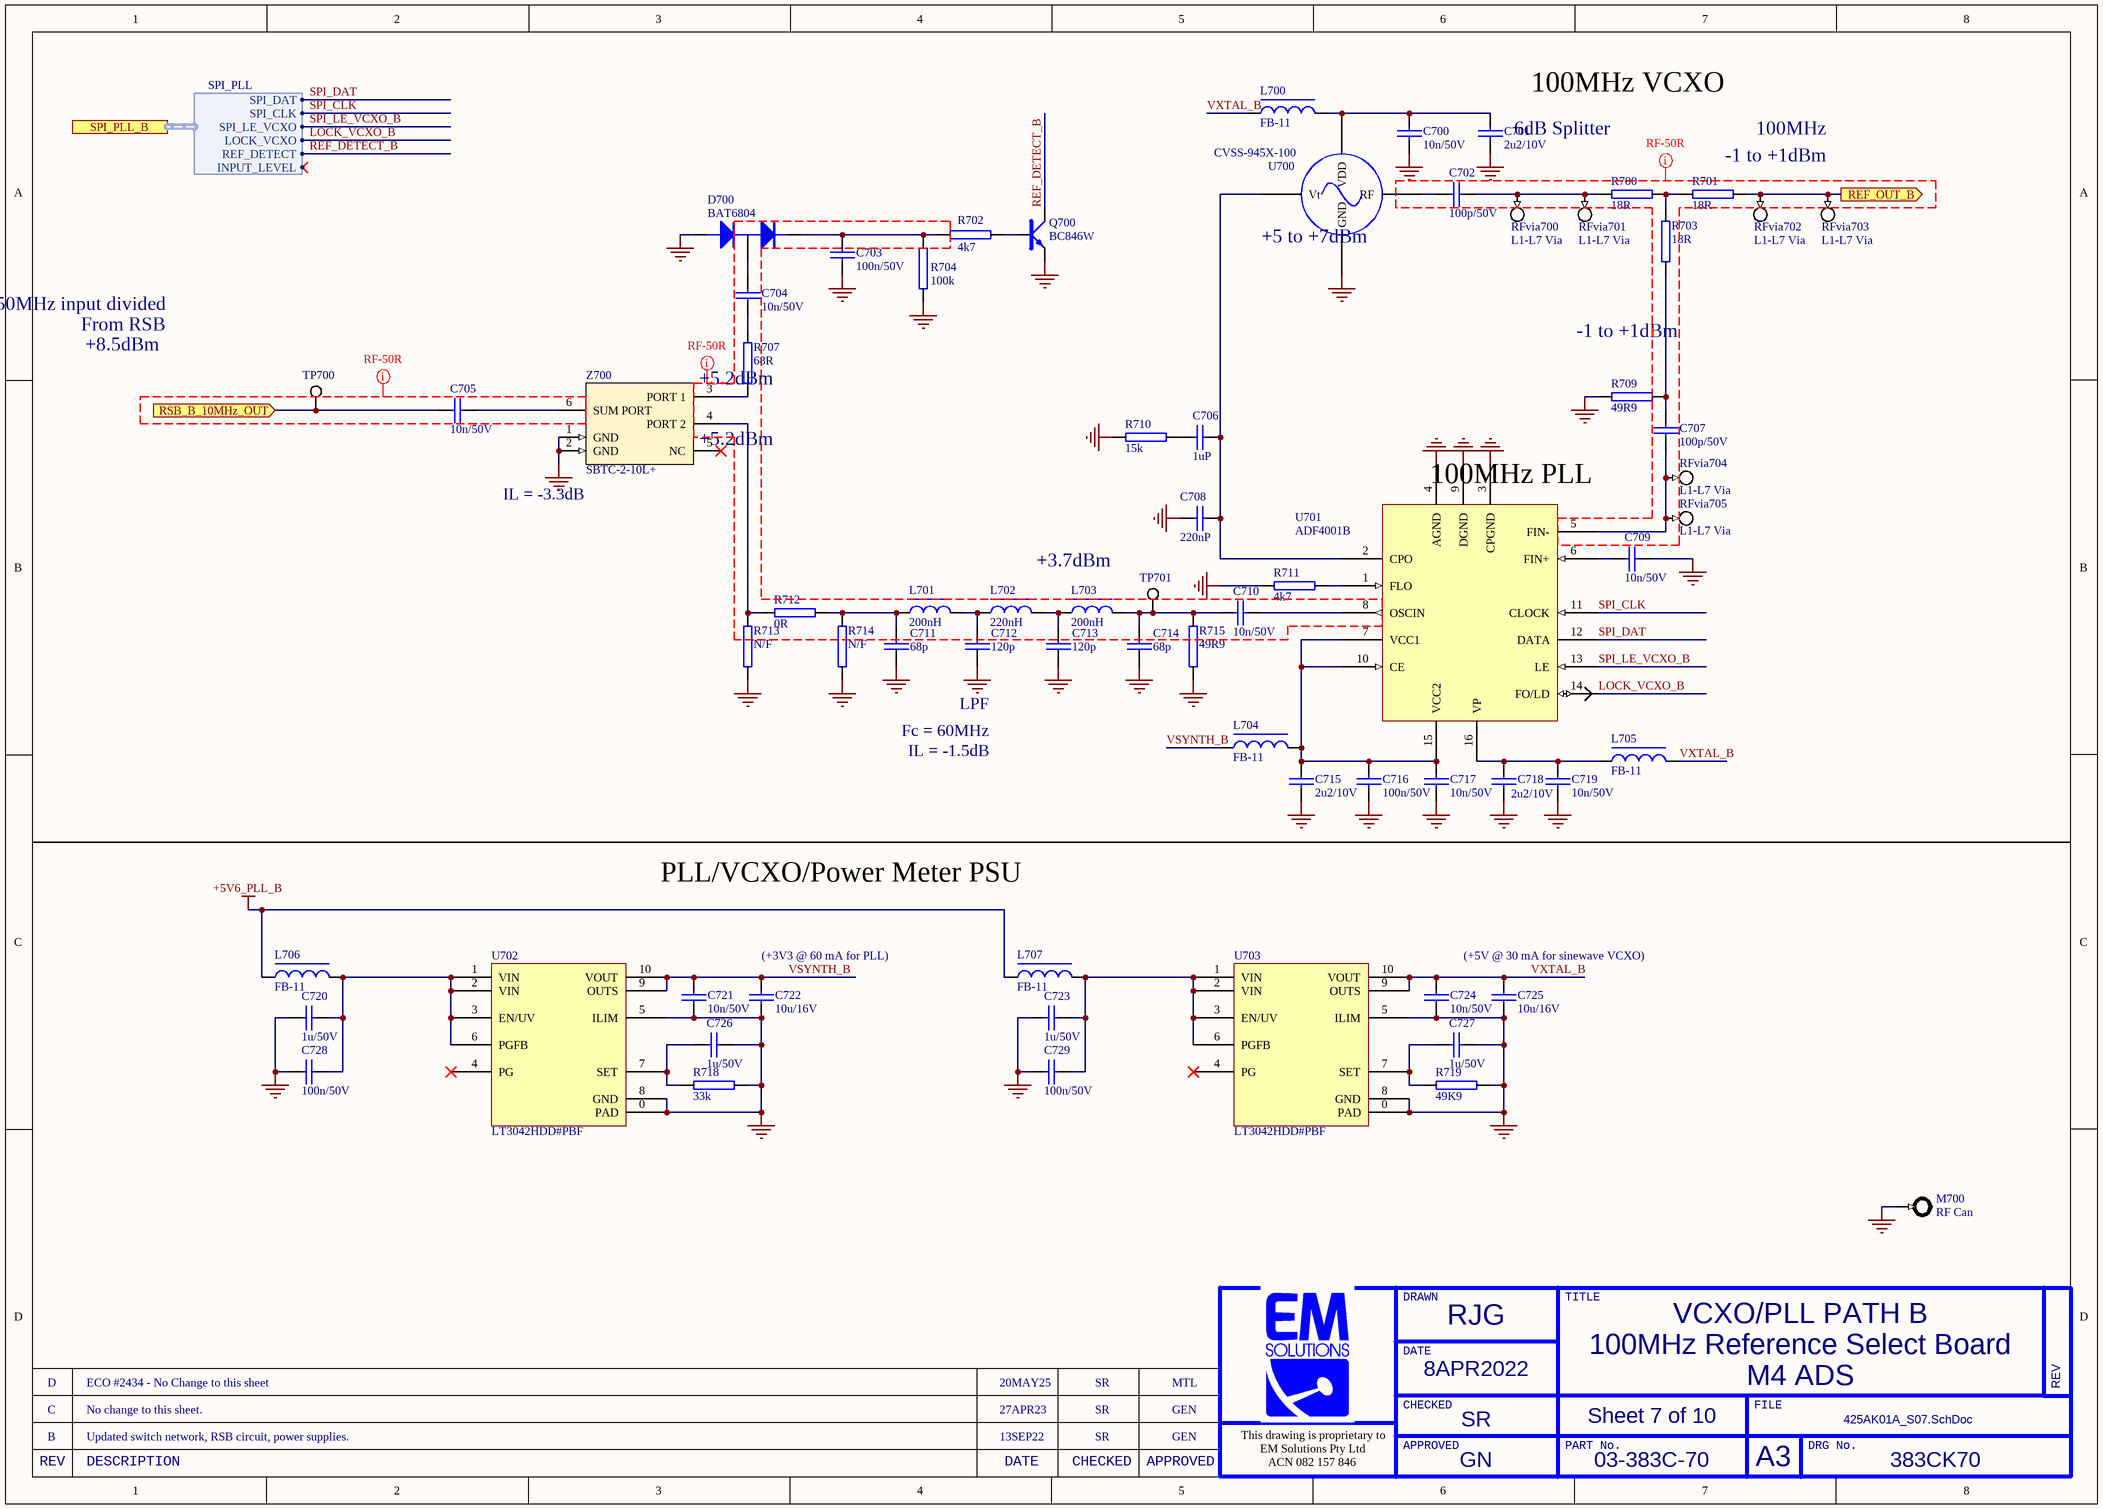
[diagram p2: 425AK01A_S07.SchDoc]

### Parts
C700  10n/50V  [0402C]
C701  2u2/10V  [0603C]
C702  100p/50V  [0402C]
C703  100n/50V  [0402C]
C704  10n/50V  [0402C]
C705  10n/50V  [0402C]
C706  1uP  [1210C]
C707  100p/50V  [0402C]
C708  220nP  [1206C]
C709  10n/50V  [0402C]
C710  10n/50V  [0402C]
C711  68p  [0402C]
C712  120p  [0402C]
C713  120p  [0402C]
C714  68p  [0402C]
C715  2u2/10V  [0603C]
C716  100n/50V  [0402C]
C717  10n/50V  [0402C]
C718  2u2/10V  [0603C]
C719  10n/50V  [0402C]
C720  1u/50V  [0603C]
C721  10n/50V  [0402C]
C722  10u/16V  [0805C]
C723  1u/50V  [0603C]
C724  10n/50V  [0402C]
C725  10u/16V  [0805C]
C726  1u/50V  [0603C]
C727  1u/50V  [0603C]
C728  100n/50V  [0402C]
C729  100n/50V  [0402C]
D700  BAT6804  [SOT-23DAP]
L700  FB-11  [0402L]
L701  200nH  [0402L]
L702  220nH  [0402L]
L703  200nH  [0402L]
L704  FB-11  [0402L]
L705  FB-11  [0402L]
L706  FB-11  [0402L]
L707  FB-11  [0402L]
M700  RF Can  [Can_38x25.4x6mm]
Q700  BC846W  [SOT-323BJT]
R700  18R  [0402]
R701  18R  [0402]
R702  4k7  [0402]
R703  18R  [0402]
R704  100k  [0402]
R707  68R  [0402]
R709  49R9  [0402]
R710  15k  [0402]
R711  4k7  [0402]
R712  0R  [0402]
R713  N/F  [0402]
R714  N/F  [0402]
R715  49R9  [0402]
R718  33k  [0402]
R719  49K9  [0402]
RFvia700  L1-L7 Via  [RFvia_L1-L7]  (no BOM)
RFvia701  L1-L7 Via  [RFvia_L1-L7]  (no BOM)
RFvia702  L1-L7 Via  [RFvia_L1-L7]  (no BOM)
RFvia703  L1-L7 Via  [RFvia_L1-L7]  (no BOM)
RFvia704  L1-L7 Via  [RFvia_L1-L7]  (no BOM)
RFvia705  L1-L7 Via  [RFvia_L1-L7]  (no BOM)
TP700  Pad  [Testpoint-0.5mm-SMT-withPaste]  (value not drawn)  (no BOM)
TP701  Pad  [Testpoint-0.5mm-SMT-withPaste]  (value not drawn)  (no BOM)
U700  CVSS-945X-100  [CVHD-950]
U701  ADF4001B  [TSSOP-16]
U702  LT3042HDD#PBF  [DFN50P300X300X80_HS-11N]
U703  LT3042HDD#PBF  [DFN50P300X300X80_HS-11N]
Z700  SBTC-2-10L+  [SBTC-2-10L+]

### Ports
REF_OUT_B (out), RSB_B_10MHz_OUT (in), SPI_PLL_B (harness SPI_PLL)

### Harnesses
SPI_PLL: SPI_LE_VCXO, SPI_CLK, SPI_DAT, REF_DETECT, LOCK_VCXO, INPUT_LEVEL

### Nets
+5V6_PLL_B: L706.2 L707.2
GND: C700.2 C701.2 C703.1 C708.1 C709.2 C711.1 C712.1 C713.1 C714.1 C715.2 C716.2 C717.2 C718.2 C719.2 C720.1 C721.1 C722.2 C723.1 C724.1 C725.2 C726.2 C727.2 C728.2 C729.2 D700.A M700.0 Q700.E R704.1 R709.2 R710.2 R711.1 R713.1 R714.1 R715.1 R718.1 R719.1 U700.2(GND) U701.3(CPGND) U701.4(AGND) U701.9(DGND) U702.0(PAD) U702.5(ILIM) U702.8(GND) U703.0(PAD) U703.5(ILIM) U703.8(GND) Z700.1(GND) Z700.2(GND)
LOCK_VCXO_B: U701.14(FO/LD) ; port SPI_PLL_B.LOCK_VCXO
REF_DETECT_B: Q700.C ; port SPI_PLL_B.REF_DETECT
SPI_CLK: U701.11(CLOCK) ; port SPI_PLL_B.SPI_CLK
SPI_DAT: U701.12(DATA) ; port SPI_PLL_B.SPI_DAT
SPI_LE_VCXO_B: U701.13(LE) ; port SPI_PLL_B.SPI_LE_VCXO
VSYNTH_B: C721.2 C722.1 L704.1 U702.9(OUTS) U702.10(VOUT)
VXTAL_B: C724.2 C725.1 L700.1 L705.2 U703.9(OUTS) U703.10(VOUT)
NetC700_1: C700.1 C701.1 L700.2 U700.4(VDD)
NetC702_1: C702.1 R700.1 RFvia700.1 RFvia701.1
NetC702_2: C702.2 U700.3(RF)
NetC703_2: C703.2 D700.K R702.2 R704.2
NetC704_1: C704.1 R707.2
NetC704_2: C704.2 D700.KA
NetC705_1: C705.1 TP700.1 ; port RSB_B_10MHz_OUT
NetC705_2: C705.2 Z700.6(SUM_PORT)
NetC706_1: C706.1 C708.2 U700.1(Vt) U701.2(CPO)
NetC706_2: C706.2 R710.1
NetC707_1: C707.1 R703.2 R709.1
NetC707_2: C707.2 RFvia704.1 RFvia705.1 U701.5(FIN-)
NetC709_1: C709.1 U701.6(FIN+)
NetC710_1: C710.1 C714.2 L703.2 R715.2 TP701.1
NetC710_2: C710.2 U701.8(OSCIN)
NetC711_2: C711.2 L701.1 R712.1 R714.2
NetC712_2: C712.2 L701.2 L702.1
NetC713_2: C713.2 L702.2 L703.1
NetC715_1: C715.1 C716.1 C717.1 L704.2 U701.7(VCC1) U701.10(CE) U701.15(VCC2)
NetC718_1: C718.1 C719.1 L705.1 U701.16(VP)
NetC720_2: C720.2 C728.1 L706.1 U702.1(VIN) U702.2(VIN) U702.3(EN/UV) U702.6(PGFB)
NetC723_2: C723.2 C729.1 L707.1 U703.1(VIN) U703.2(VIN) U703.3(EN/UV) U703.6(PGFB)
NetC726_1: C726.1 R718.2 U702.7(SET)
NetC727_1: C727.1 R719.2 U703.7(SET)
NetC928_1: R701.2 RFvia702.1 RFvia703.1 ; port REF_OUT_B
NetQ700_B: Q700.B R702.1
NetR700_2: R700.2 R701.1 R703.1
NetR707_1: R707.1 Z700.3(PORT_1)
NetR711_2: R711.2 U701.1(FLO)
NetR712_2: R712.2 R713.2 Z700.4(PORT_2)

Not connected (* = marked no-connect by the designer): U702 4(PG)*; U703 4(PG)*; Z700 5(NC)*

### Layout directives
net class RF-50R: (no net found under the mark), GND

### Notes on the sheet
- 100MHz VCXO
- 6dB Splitter
- 100MHz
- (near RFvia703) -1 to +1dBm
- (near U700) +5 to +7dBm
- 10MHz from 10MHz input or 50MHz input divided
- +8.5dBm
- From RSB
- -1 to +1dBm
- (near R707) +5.2dBm
- +5.2dBm
- (near Z700) IL = -3.3dB
- (near U701) 100MHz PLL
- +3.7dBm
- LPF
- Fc = 60MHz
- IL = -1.5dB
- PLL/VCXO/Power Meter PSU
- (near C722) (+3V3 @ 60 mA for PLL)
- (+5V @ 30 mA for sinewave VCXO)
- D
- ECO #2434 - No Change to this sheet
- 20MAY25
- SR
- MTL
- B
- C
- Updated switch network, RSB circuit, power supplies.
- No change to this sheet.
- 13SEP22
- 27APR23
- GEN
- DRAWN
- TITLE
- DATE
- REV
- This drawing is proprietary to
- EM Solutions Pty Ltd
- APPROVED
- CHECKED
- PART No.
- FILE
- A3
- DRG No.
- DESCRIPTION
- ACN 082 157 846

### Library data of the parts
C700 C704 C709 C710 C717 C719 C721 C724 = 41-010N-12: as C400 on sheet 425AK01A_S04; Part Number: 41-010N-12; ItemID: 41-010N-12
C701 C715 C718 = 41-02U2-06: as C401 on sheet 425AK01A_S04; Part Number: 41-02U2-06; ItemID: 41-02U2-06
C702 = 41-100P-11: as C402 on sheet 425AK01A_S04; Part Number: 41-100P-11; ItemID: 41-100P-11
C703 C716 C728 C729 = 41-100N-13: as C403 on sheet 425AK01A_S04; Part Number: 41-100N-13; ItemID: 41-100N-13
C705 = 41-010N-12: as C100 on sheet 425AK01A_S01; Part Number: 41-010N-12; ItemID: 41-010N-12
C706 = 41-01U0-05: as C406 on sheet 425AK01A_S04; Part Number: 41-01U0-05; ItemID: 41-01U0-05
C707 = 41-100P-11: as C407 on sheet 425AK01A_S04; Part Number: 41-100P-11; ItemID: 41-100P-11
C708 = 41-220N-05: as C408 on sheet 425AK01A_S04; Part Number: 41-220N-05; ItemID: 41-220N-05
C711 C714 = 41-068P-08: Capacitor, 0402, 68p; Part Number: 41-068P-08
C712 C713 = 41-120P-05: Capacitor, 0402, 120p NPO; Part Number: 41-120P-05
C720 C723 C726 C727 = 41-01U0-06: as C420 on sheet 425AK01A_S04; Part Number: 41-01U0-06; ItemID: 41-01U0-06
C722 C725 = 41-010U-08: as C422 on sheet 425AK01A_S04; Part Number: 41-010U-08; ItemID: 41-010U-08
D700 = 60-BAT68-04: as D400 on sheet 425AK01A_S04; Part Number: 60-BAT68-04; ItemID: 60-BAT68-04
L700 L704 L705 = 46-B-11: as L400 on sheet 425AK01A_S04; Part Number: 46-B-11; ItemID: 46-B-11
L701 L703 = 46-200N-04: Inductor, Chip, 200nH, 0402; Part Number: 46-200N-04
L702 = 46-220N-05: Inductor, Chip, 220nH, 0402; Part Number: 46-220N-05
L706 L707 = 46-B-11: as L406 on sheet 425AK01A_S04; Part Number: 46-B-11; ItemID: 46-B-11
M700 = Can-RF: Part Number: 11-0256
Q700 = 62-BC846-01: as Q400 on sheet 425AK01A_S04; Part Number: 62-BC846-01; ItemID: 62-BC846-01
R700 R701 R703 = 44-018R-10: as R400 on sheet 425AK01A_S04; Part Number: 44-018R-10; ItemID: 44-018R-10; MODELNAME: GENERIC
R702 R711 = 44-04K7-10: as R402 on sheet 425AK01A_S04; Part Number: 44-04K7-10; ItemID: 44-04K7-10
R704 = 44-100K-10: as R404 on sheet 425AK01A_S04; Part Number: 44-100K-10; ItemID: 44-100K-10
R707 = 44-068R-10: as R407 on sheet 425AK01A_S04; Part Number: 44-068R-10; ItemID: 44-068R-10
R709 R715 = 44-049R9-10: as R409 on sheet 425AK01A_S04; Part Number: 44-049R9-10; ItemID: 44-049R9-10
R710 = 44-015K-10: as R410 on sheet 425AK01A_S04; Part Number: 44-015K-10; ItemID: 44-015K-10
R712 = 44-000R-10: as R412 on sheet 425AK01A_S04; Part Number: 44-000R-10; ItemID: 44-000R-10; MODELNAME: GENERIC
R713 R714 = 44-N/F-10: as R413 on sheet 425AK01A_S04; Part Number: 44-N/F-10; ItemID: 44-N/F-10
R718 = 44-033K-10: as R418 on sheet 425AK01A_S04; Part Number: 44-033K-10; ItemID: 44-033K-10
R719 = 44-49K9-01: as R419 on sheet 425AK01A_S04; Part Number: 44-49K9-01; ItemID: 44-49K9-01
RFvia700-RFvia705 = RFvia_L1-L7: as RFvia100 on sheet 425AK01A_S01
TP700 TP701 = Pad: as TP400 on sheet 425AK01A_S04
U700 = 35-0223: as U400 on sheet 425AK01A_S04; Part Number: 35-0223; ItemID: 35-0223; MODELNAME: CVSS-945X-100
U701 = 54-4001-01: as U401 on sheet 425AK01A_S04; Part Number: 54-4001-01; ItemID: 54-4001-01; MODELNAME: ADF4001BRUZ
U702 U703 = 52-3042-01: as U402 on sheet 425AK01A_S04; Part Number: 52-3042-01; ItemID: 52-3042-01
Z700 = 33-0055: as Z400 on sheet 425AK01A_S04; Part Number: 33-0055; MODELNAME: SBTC-2-10L+; ItemID: 33-0055

## Sheet 425AK01A_S09.SchDoc
size A3; DocumentNumber: 9; SheetNumber: 9; SheetTotal: 10; PageSetup: Record=PageOptions|CenterHorizontal=True|CenterVertical=True|PrintScale=1.01|XCorrection=1.00|YCorrection=1.00|PrintKind=1|BorderSize=5000000|LeftOffset=0|BottomOffset=0|Orientation=2|PaperLength=1000|PaperWidth=1000|Scale=100|PaperSource=15|PrintQuality=600|MediaType=1|DitherType=10|PaperKind=A3|PrintScaleMode=1; 00_Rev: D; 00_Drawn: RJG; 00_Date: 8APR2022; 00_Checked: SR; 00_Approved: GN; 00_Line2: 100MHz Reference Select Board; 00_Line3: M4 ADS; 00_Line1: Switches and Output Buffers
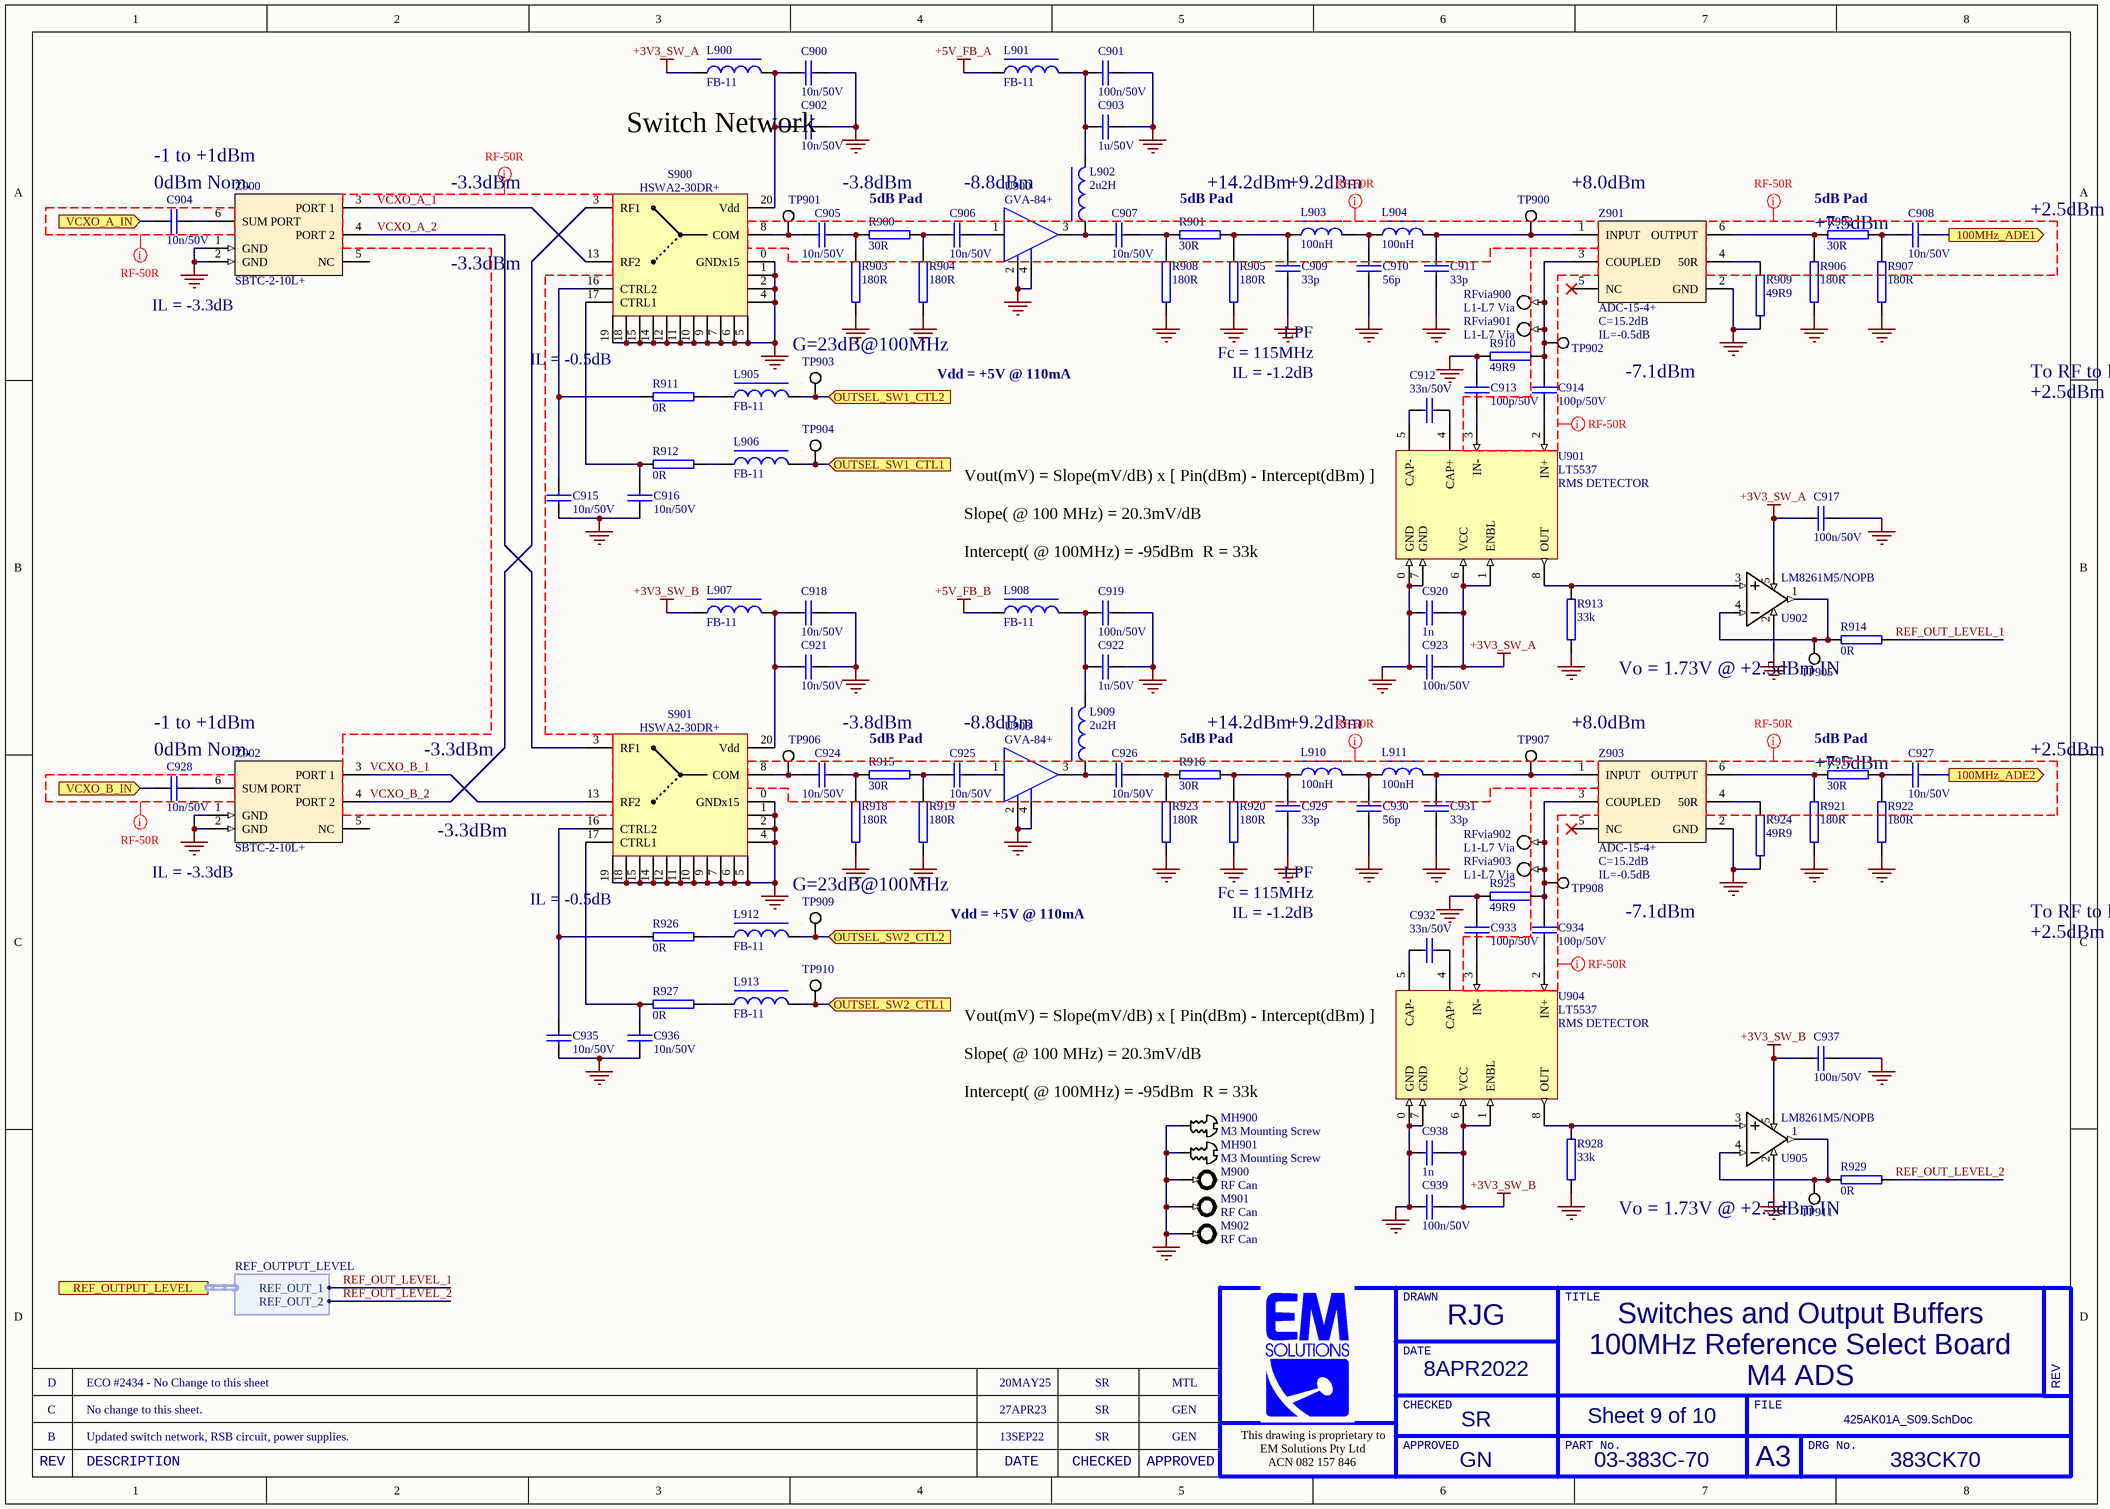
[diagram p3: 425AK01A_S09.SchDoc]

### Parts
C900  10n/50V  [0402C]
C901  100n/50V  [0402C]
C902  10n/50V  [0402C]
C903  1u/50V  [0603C]
C904  10n/50V  [0402C]
C905  10n/50V  [0402C]
C906  10n/50V  [0402C]
C907  10n/50V  [0402C]
C908  10n/50V  [0402C]
C909  33p  [0402C]
C910  56p  [0402C]
C911  33p  [0402C]
C912  33n/50V  [0402C]
C913  100p/50V  [0402C]
C914  100p/50V  [0402C]
C915  10n/50V  [0402C]
C916  10n/50V  [0402C]
C917  100n/50V  [0402C]
C918  10n/50V  [0402C]
C919  100n/50V  [0402C]
C920  1n  [0402C]
C921  10n/50V  [0402C]
C922  1u/50V  [0603C]
C923  100n/50V  [0402C]
C924  10n/50V  [0402C]
C925  10n/50V  [0402C]
C926  10n/50V  [0402C]
C927  10n/50V  [0402C]
C928  10n/50V  [0402C]
C929  33p  [0402C]
C930  56p  [0402C]
C931  33p  [0402C]
C932  33n/50V  [0402C]
C933  100p/50V  [0402C]
C934  100p/50V  [0402C]
C935  10n/50V  [0402C]
C936  10n/50V  [0402C]
C937  100n/50V  [0402C]
C938  1n  [0402C]
C939  100n/50V  [0402C]
L900  FB-11  [0402L]
L901  FB-11  [0402L]
L902  2u2H  [0805L]
L903  100nH  [0402L]
L904  100nH  [0402L]
L905  FB-11  [0402L]
L906  FB-11  [0402L]
L907  FB-11  [0402L]
L908  FB-11  [0402L]
L909  2u2H  [0805L]
L910  100nH  [0402L]
L911  100nH  [0402L]
L912  FB-11  [0402L]
L913  FB-11  [0402L]
M900  RF Can  [Can_38x25.4x6mm]
M901  RF Can  [Can_38x25.4x6mm]
M902  RF Can  [Can_38x25.4x6mm]
MH900  M3 Mounting Screw  [M3_SCREW]  (no BOM)
MH901  M3 Mounting Screw  [M3_SCREW]  (no BOM)
R900  30R  [0402]
R901  30R  [0402]
R902  30R  [0402]
R903  180R  [0402]
R904  180R  [0402]
R905  180R  [0402]
R906  180R  [0402]
R907  180R  [0402]
R908  180R  [0402]
R909  49R9  [0402]
R910  49R9  [0402]
R911  0R  [0402]
R912  0R  [0402]
R913  33k  [0402]
R914  0R  [0402]
R915  30R  [0402]
R916  30R  [0402]
R917  30R  [0402]
R918  180R  [0402]
R919  180R  [0402]
R920  180R  [0402]
R921  180R  [0402]
R922  180R  [0402]
R923  180R  [0402]
R924  49R9  [0402]
R925  49R9  [0402]
R926  0R  [0402]
R927  0R  [0402]
R928  33k  [0402]
R929  0R  [0402]
RFvia900  L1-L7 Via  [RFvia_L1-L7]  (no BOM)
RFvia901  L1-L7 Via  [RFvia_L1-L7]  (no BOM)
RFvia902  L1-L7 Via  [RFvia_L1-L7]  (no BOM)
RFvia903  L1-L7 Via  [RFvia_L1-L7]  (no BOM)
S900  HSWA2-30DR+  [DG983-1]
S901  HSWA2-30DR+  [DG983-1]
TP900  Pad  [Testpoint-0.5mm-SMT-withPaste]  (value not drawn)  (no BOM)
TP901  Pad  [Testpoint-0.5mm-SMT-withPaste]  (value not drawn)  (no BOM)
TP902  Pad  [Testpoint-0.5mm-SMT-withPaste]  (value not drawn)  (no BOM)
TP903  Pad  [Testpoint-0.5mm-SMT-withPaste]  (value not drawn)  (no BOM)
TP904  Pad  [Testpoint-0.5mm-SMT-withPaste]  (value not drawn)  (no BOM)
TP905  Pad  [Testpoint-0.5mm-SMT-withPaste]  (value not drawn)  (no BOM)
TP906  Pad  [Testpoint-0.5mm-SMT-withPaste]  (value not drawn)  (no BOM)
TP907  Pad  [Testpoint-0.5mm-SMT-withPaste]  (value not drawn)  (no BOM)
TP908  Pad  [Testpoint-0.5mm-SMT-withPaste]  (value not drawn)  (no BOM)
TP909  Pad  [Testpoint-0.5mm-SMT-withPaste]  (value not drawn)  (no BOM)
TP910  Pad  [Testpoint-0.5mm-SMT-withPaste]  (value not drawn)  (no BOM)
TP911  Pad  [Testpoint-0.5mm-SMT-withPaste]  (value not drawn)  (no BOM)
U900  GVA-84+  [SOT-89-RF]
U901  LT5537  [DFN-8]
U902  LM8261M5/NOPB  [SOT-23/5]
U903  GVA-84+  [SOT-89-RF]
U904  LT5537  [DFN-8]
U905  LM8261M5/NOPB  [SOT-23/5]
Z900  SBTC-2-10L+  [SBTC-2-10L+]
Z901  ADC-15-4+  [ADC-15-4+]
Z902  SBTC-2-10L+  [SBTC-2-10L+]
Z903  ADC-15-4+  [ADC-15-4+]

### Ports
100MHz_ADE1 (out), 100MHz_ADE2 (out), OUTSEL_SW1_CTL1 (in), OUTSEL_SW1_CTL2 (in), OUTSEL_SW2_CTL1 (in), OUTSEL_SW2_CTL2 (in), REF_OUTPUT_LEVEL (harness REF_OUTPUT_LEVEL), VCXO_A_IN (in), VCXO_B_IN (in)

### Harnesses
REF_OUTPUT_LEVEL: REF_OUT_1, REF_OUT_2

### Nets
+3V3_SW_A: C917.1 C920.2 C923.1 L900.2 U901.1(ENBL) U901.6(VCC) U902.5(V+)
+3V3_SW_B: C937.1 C938.2 C939.1 L907.2 U904.1(ENBL) U904.6(VCC) U905.5(V+)
+5V_FB_A: L901.1
+5V_FB_B: L908.1
GND: C900.1 C901.2 C902.2 C903.1 C909.2 C910.2 C911.1 C913.1 C915.1 C916.1 C917.2 C918.1 C919.2 C920.1 C921.2 C922.1 C923.2 C929.2 C930.2 C931.1 C933.1 C935.1 C936.1 C937.2 C938.1 C939.2 M900.0 M901.0 M902.0 MH900.1 MH901.1 R903.1 R904.1 R905.1 R906.1 R907.1 R908.1 R909.1 R910.1 R913.1 R918.1 R919.1 R920.1 R921.1 R922.1 R923.1 R924.1 R925.1 R928.1 S900.0(GNDx15) S900.1(GND) S900.2(GND) S900.4(GND) S900.5(GND) S900.6(GND) S900.7(GND) S900.9(GND) S900.10(GND) S900.11(GND) S900.12(GND) S900.14(GND) S900.15(GND) S900.18(GND) S900.19(GND) S901.0(GNDx15) S901.1(GND) S901.2(GND) S901.4(GND) S901.5(GND) S901.6(GND) S901.7(GND) S901.9(GND) S901.10(GND) S901.11(GND) S901.12(GND) S901.14(GND) S901.15(GND) S901.18(GND) S901.19(GND) U900.2 U900.4 U901.0(GND) U901.7(GND) U902.2(V-) U903.2 U903.4 U904.0(GND) U904.7(GND) U905.2(V-) Z900.1(GND) Z900.2(GND) Z901.2(GND) Z902.1(GND) Z902.2(GND) Z903.2(GND)
REF_OUT_LEVEL_1: R914.2 ; port REF_OUTPUT_LEVEL.REF_OUT_1
REF_OUT_LEVEL_2: R929.2 ; port REF_OUTPUT_LEVEL.REF_OUT_2
VCXO_A_1: S900.13(RF2) Z900.3(PORT_1)
VCXO_A_2: S901.3(RF1) Z900.4(PORT_2)
VCXO_B_1: S901.13(RF2) Z902.3(PORT_1)
VCXO_B_2: S900.3(RF1) Z902.4(PORT_2)
NetC900_2: C900.2 C902.1 L900.1 S900.20(Vdd)
NetC901_1: C901.1 C903.2 L901.2 L902.2
NetC904_1: C904.1 ; port VCXO_A_IN
NetC904_2: C904.2 Z900.6(SUM_PORT)
NetC905_1: C905.1 S900.8(COM) TP901.1
NetC905_2: C905.2 R900.2 R903.2
NetC906_1: C906.1 R900.1 R904.2
NetC906_2: C906.2 U900.1
NetC907_1: C907.1 L902.1 U900.3
NetC907_2: C907.2 R901.2 R908.2
NetC908_1: C908.1 R902.1 R907.2
NetC908_2: C908.2 ; port 100MHz_ADE1
NetC909_1: C909.1 L903.1 R901.1 R905.2
NetC910_1: C910.1 L903.2 L904.1
NetC911_2: C911.2 L904.2 TP900.1 Z901.1(INPUT)
NetC912_1: C912.1 U901.5(CAP-)
NetC912_2: C912.2 U901.4(CAP+)
NetC913_2: C913.2 U901.3(IN-)
NetC914_1: C914.1 R910.2 RFvia900.1 RFvia901.1 TP902.1 Z901.3(COUPLED)
NetC914_2: C914.2 U901.2(IN+)
NetC915_2: C915.2 R911.2 S900.16(CTRL2)
NetC916_2: C916.2 R912.2 S900.17(CTRL1)
NetC918_2: C918.2 C921.1 L907.1 S901.20(Vdd)
NetC919_1: C919.1 C922.2 L908.2 L909.2
NetC924_1: C924.1 S901.8(COM) TP906.1
NetC924_2: C924.2 R915.2 R918.2
NetC925_1: C925.1 R915.1 R919.2
NetC925_2: C925.2 U903.1
NetC926_1: C926.1 L909.1 U903.3
NetC926_2: C926.2 R916.2 R923.2
NetC927_1: C927.1 R917.1 R922.2
NetC927_2: C927.2 ; port 100MHz_ADE2
NetC928_1: C928.1 ; port VCXO_B_IN
NetC928_2: C928.2 Z902.6(SUM_PORT)
NetC929_1: C929.1 L910.1 R916.1 R920.2
NetC930_1: C930.1 L910.2 L911.1
NetC931_2: C931.2 L911.2 TP907.1 Z903.1(INPUT)
NetC932_1: C932.1 U904.5(CAP-)
NetC932_2: C932.2 U904.4(CAP+)
NetC933_2: C933.2 U904.3(IN-)
NetC934_1: C934.1 R925.2 RFvia902.1 RFvia903.1 TP908.1 Z903.3(COUPLED)
NetC934_2: C934.2 U904.2(IN+)
NetC935_2: C935.2 R926.2 S901.16(CTRL2)
NetC936_2: C936.2 R927.2 S901.17(CTRL1)
NetL905_1: L905.1 TP903.1 ; port OUTSEL_SW1_CTL2
NetL905_2: L905.2 R911.1
NetL906_1: L906.1 TP904.1 ; port OUTSEL_SW1_CTL1
NetL906_2: L906.2 R912.1
NetL912_1: L912.1 TP909.1 ; port OUTSEL_SW2_CTL2
NetL912_2: L912.2 R926.1
NetL913_1: L913.1 TP910.1 ; port OUTSEL_SW2_CTL1
NetL913_2: L913.2 R927.1
NetR902_2: R902.2 R906.2 Z901.6(OUTPUT)
NetR909_2: R909.2 Z901.4(50R)
NetR913_2: R913.2 U901.8(OUT) U902.3(IN+)
NetR914_1: R914.1 TP905.1 U902.1(OUT) U902.4(IN-)
NetR917_2: R917.2 R921.2 Z903.6(OUTPUT)
NetR924_2: R924.2 Z903.4(50R)
NetR928_2: R928.2 U904.8(OUT) U905.3(IN+)
NetR929_1: R929.1 TP911.1 U905.1(OUT) U905.4(IN-)

Not connected (* = marked no-connect by the designer): Z900 5(NC); Z901 5(NC)*; Z902 5(NC); Z903 5(NC)*

### Layout directives
net class RF-50R: (no net found under the mark), VCXO_A_1, VCXO_A_2, VCXO_B_1, VCXO_B_2

### Notes on the sheet
- -1 to +1dBm
- Switch Network
- (near C904) 0dBm Nom.
- (near Z900) -3.3dBm
- -3.8dBm
- 5dB Pad
- -8.8dBm
- (near R901) 5dB Pad
- +14.2dBm
- +9.2dBm
- (near TP900) +8.0dBm
- (near R902) 5dB Pad
- (near R902) +7.5dBm
- (near C908) +2.5dBm
- (near Z900) IL = -3.3dB
- IL = -0.5dB
- Vdd = +5V @ 110mA
- (near R904) G=23dB@100MHz
- LPF
- Fc = 115MHz
- (near C912) IL = -1.2dB
- C=15.2dB
- IL=-0.5dB
- -7.1dBm
- To RF to Fibre Converter to ADE 1
- +2.5dBm Nom.
- (near U901) RMS DETECTOR
- (near U901) Vout(mV) = Slope(mV/dB) x [ Pin(dBm) - Intercept(dBm) ]
  Slope( @ 100 MHz) = 20.3mV/dB
  Intercept( @ 100MHz) = -95dBm  R = 33k
- Vo = 1.73V @ +2.5dBm IN
- (near C928) 0dBm Nom.
- (near Z902) -3.3dBm
- (near R916) 5dB Pad
- (near TP907) +8.0dBm
- (near R917) 5dB Pad
- (near R917) +7.5dBm
- (near C927) +2.5dBm
- (near Z902) IL = -3.3dB
- (near R919) G=23dB@100MHz
- (near C932) IL = -1.2dB
- To RF to Fibre Converter to ADE 2
- (near U904) RMS DETECTOR
- Vout(mV) = Slope(mV/dB) x [ Pin(dBm) - Intercept(dBm) ]
  Slope( @ 100 MHz) = 20.3mV/dB
  Intercept( @ 100MHz) = -95dBm  R = 33k
- D
- ECO #2434 - No Change to this sheet
- 20MAY25
- SR
- MTL
- B
- C
- Updated switch network, RSB circuit, power supplies.
- No change to this sheet.
- 13SEP22
- 27APR23
- GEN
- DRAWN
- TITLE
- DATE
- REV
- This drawing is proprietary to
- EM Solutions Pty Ltd
- APPROVED
- CHECKED
- PART No.
- FILE
- A3
- DRG No.
- DESCRIPTION
- ACN 082 157 846

### Library data of the parts
C900 C918 = 41-010N-12: as C400 on sheet 425AK01A_S04; Part Number: 41-010N-12; ItemID: 41-010N-12
C901 C919 = 41-100N-13: as C101 on sheet 425AK01A_S01; Part Number: 41-100N-13; ItemID: 41-100N-13
C902 C904-C908 C915 C916 C921 C924-C928 C935 C936 = 41-010N-12: as C100 on sheet 425AK01A_S01; Part Number: 41-010N-12; ItemID: 41-010N-12
C903 C922 = 41-01U0-06: Capacitor, 0603, 1u X7R 10% 50V Ceramic, NiSn; MANUFACTURER: TAIYOYUDEN; ID: 2287; MODELNAME: UMK107AB7105KA; Part Number: 41-01U0-06; ItemID: 41-01U0-06
C909 C911 C929 C931 = 41-033P-10: Capacitor, 0402, 33p NPO 2% 50V HiQ, NiSn; MANUFACTURER: MURATA; ID: 2339; MODELNAME: GJM1555C1H330GB01D; Part Number: 41-033P-10; ItemID: 41-033P-10
C910 C930 = 41-056P-05: Capacitor, 0402, 56p NPO 5% 50V Ceramic, NiSn; MANUFACTURER: YAGEO; ID: 2398; MODELNAME: CC0402JRNP09BN560; Part Number: 41-056P-05; ItemID: 41-056P-05
C912 C932 = 41-033N-01: *Capacitor, 0402, 33n, X7R, 10%, 50V; Part Number: 41-033N-01
C913 C914 C933 C934 = 41-100P-11: as C402 on sheet 425AK01A_S04; Part Number: 41-100P-11; ItemID: 41-100P-11
C917 C923 C937 C939 = 41-100N-13: as C403 on sheet 425AK01A_S04; Part Number: 41-100N-13; ItemID: 41-100N-13
C920 C938 = 1n_50V_0402: Capacitor, 0402, 1n X7R 10% 50V Ceramic, NiSn; Part Number: 41-01N0-05
L900 L901 L905-L908 L912 L913 = 46-B-11: Solid Inductor, 600ohm@100MHz, DCR=0.52, 0.3A, 0402 size; MANUFACTURER: TDK; ID: 3256; MODELNAME: MMZ1608B301CTAH0; Part Number: 46-B-11; ItemID: 46-B-11
L902 L909 = 46-02U2-01: Inductor, Chip, 2u2H 10%, 0805, SIMID08B Series; MANUFACTURER: SIEMENS; MODELNAME: B82498-B3222-K; Part Number: 46-02U2-01; Category: EMS Parts Master
L903 L904 L910 L911 = 46-100N-03: Inductor, Chip, 100nH, 0402; Part Number: 46-100N-03
M900-M902 = Can-RF: Part Number: 11-0256
MH900 MH901 = M3 Screw
R900-R902 R915-R917 = 44-030R-04: Resistor, 30R, 0402, 1%, 100mW; Part Number: 44-030R-04
R903-R908 R918-R923 = 44-180R-10: Resistor, 0402, 180R 1% 0.063W; MANUFACTURER: GENERIC; ID: 2981; Part Number: 44-180R-10; MODELNAME: GENERIC; ItemID: 44-180R-10
R909 R910 R924 R925 = 44-049R9-10: Resistor, 0402, 49R9 1% 0.063W; MODELNAME: RC0402FR-0749R9L; ID: 2787; Part Number: 44-049R9-10; ItemID: 44-049R9-10
R911 R912 R926 R927 = 44-000R-10: as R412 on sheet 425AK01A_S04; Part Number: 44-000R-10; ItemID: 44-000R-10; MODELNAME: GENERIC
R913 R928 = 44-033K-10: Resistor, 0402, 33k 1% 0.063W; MANUFACTURER: GENERIC; ID: 2720; Part Number: 44-033K-10; ItemID: 44-033K-10; MODELNAME: GENERIC
R914 R929 = 44-000R-10: Resistor, 0402, 0R 1% 0.063W; Part Number: 44-000R-10
RFvia900-RFvia903 = RFvia_L1-L7: as RFvia100 on sheet 425AK01A_S01
S900 S901 = HSWA2-30DR+: RF Switch, SPDT, DC-3GHz, Absorptive, IL=1dB, I=60dB, P=30dBm, 2V7-3V3, 4x4 QFN; MANUFACTURER: MINICCTS; ID: 3484; Part Number: 54-30-01; MODELNAME: HSWA2-30DR+; ItemID: 54-30-01
TP900-TP911 = Pad: as TP400 on sheet 425AK01A_S04
U900 U903 = GVA-84+: MMIC, DC-7GHz, G=24dB, P1dB=20.5dBm, SOT-89; Part Number: 58-GVA84-01
U901 U904 = LT5537EDDB: RF Detector, 10-1000MHz, 83dB, -40/+85C, 8-DFN 3x2mm; Part Number: 54-5537-01; MPN: LT5537EDDB
U902 U905 = OpAmp-LM8261: Opamp, RRIO, 2V5 to 30V supply, 21MHz GBWP; Part Number: 52-8621-01
Z900 Z902 = 33-0055: as Z400 on sheet 425AK01A_S04; Part Number: 33-0055; ItemID: 33-0055; MODELNAME: SBTC-2-10L+
Z901 Z903 = 33-0058: Directional Coupler, C=15.5dB, 5-1000MHz, SM; MANUFACTURER: MINICCTS; ID: 2077; Part Number: 33-0058; MODELNAME: ADC-15-4+; ItemID: 33-0058